# Altium project NXP_FRDM_IMX93.PrjPcb (part 12 of 13)

## Sheet E-21 DEBUG_RTC_USB A_CAN.SchDoc: FRDM-IMX93
size 513 x 386 mm; DrawnBy: FORLINX; Organization: ORGANIZATION; Address1: ADDRESS 1; Address2: ADDRESS 2; Address3: ADDRESS 3; Address4: ADDRESS 4; Revision: -; ENG_APP_DATE: --/--/--; DSN_APP_DATE: --/--/--; CHK_APP_DATE: --/--/--; Classification: Public, Company Internal/Proprietary, Company Confidential,  Company Secret; Page Create Date: March  8, 1995; OrgName: NXP Semiconductor; FIUO: A; OrgAddr1: NO. 192 Liangjing Rd. Pudong New Area, ShangHai; Page Number: 21; PageTitle: DEBUG/RTC/USB A/CAN; Page Size: C; Page Count: 23; Designer: FORLINX; RevCode: B1; Approver: NXP SE; Doc: SCH-94611 PDF: SPF-94611; DsnPath: T:\FILES\Designs\Single Board Computers\i.MX93-FRDM\Design Files\SCH-94611_B1.DSN; SchematicName: FRDM-i.MX 93 Development Board; PageName: E-21 DEBUG/RTC/USB A/CAN; PageSize: C; TopSchematic: True
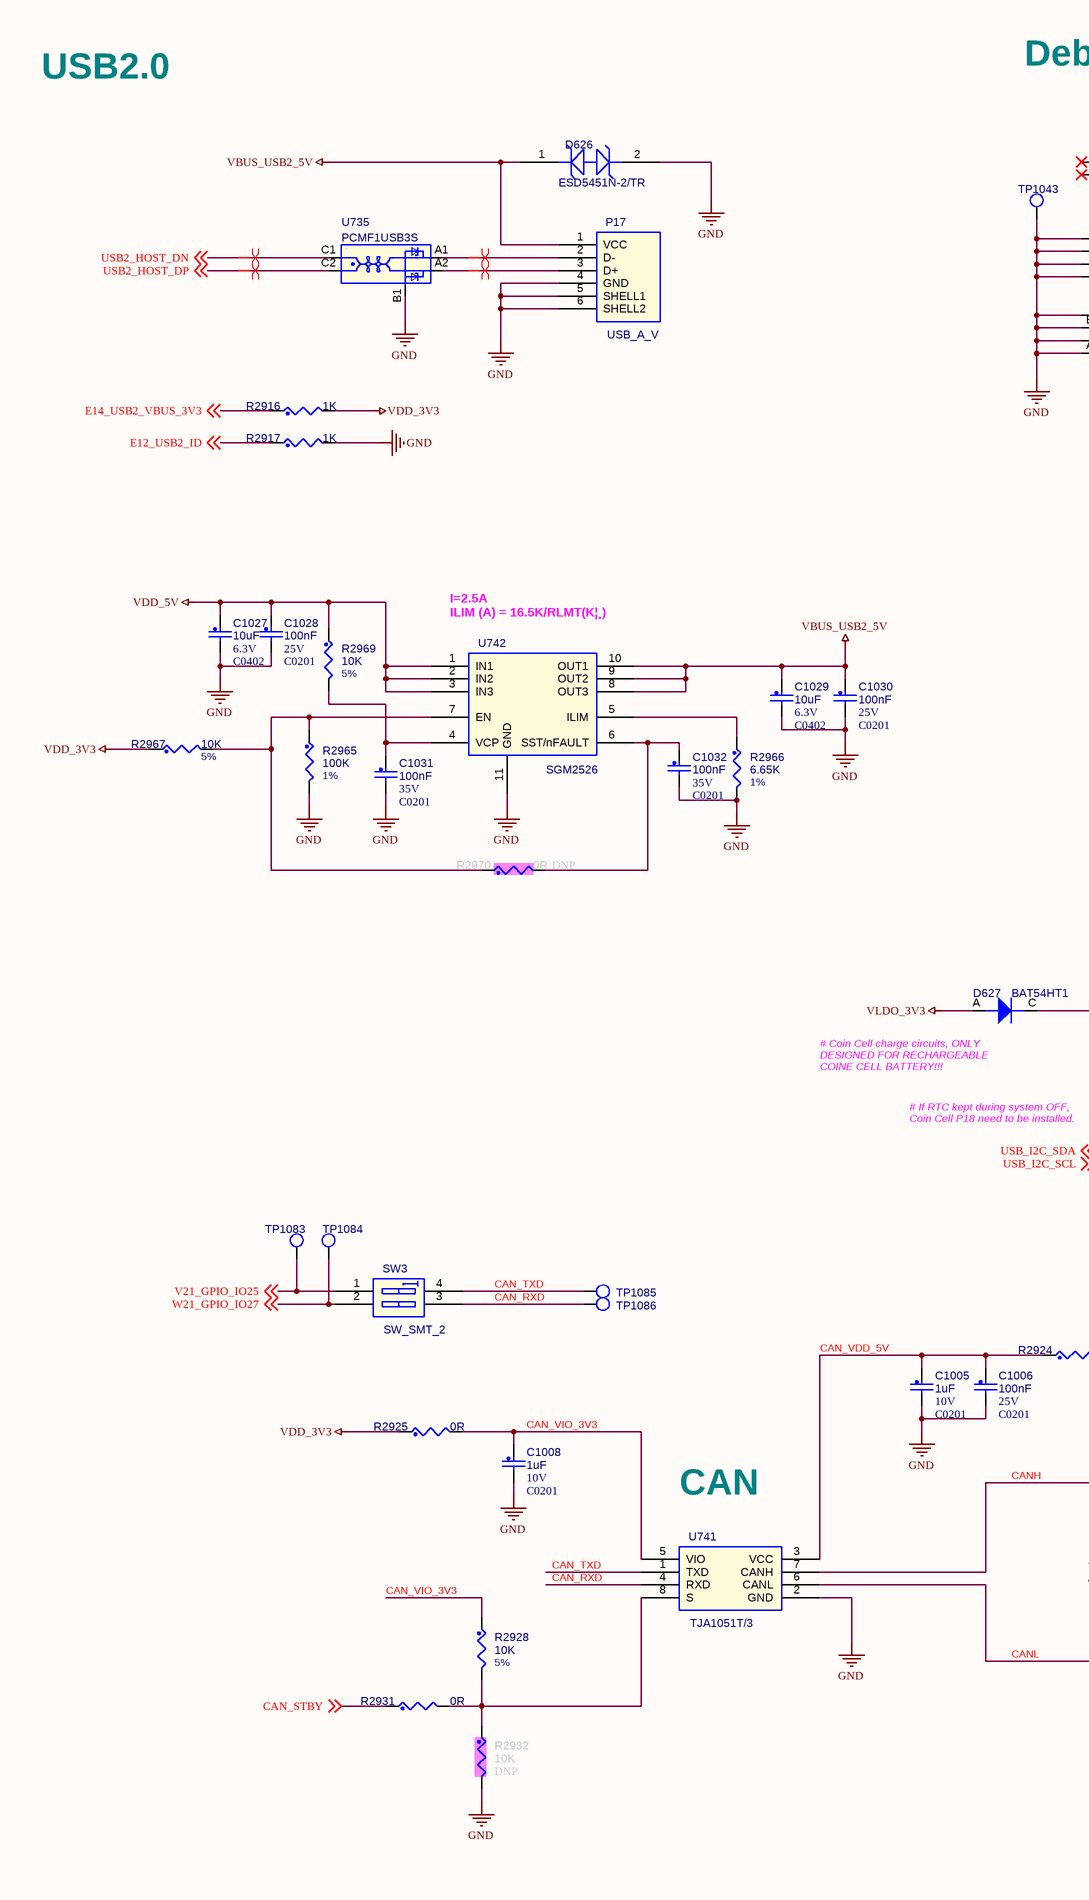
[diagram p37: E-21 DEBUG_RTC_USB A_CAN.SchDoc, left]
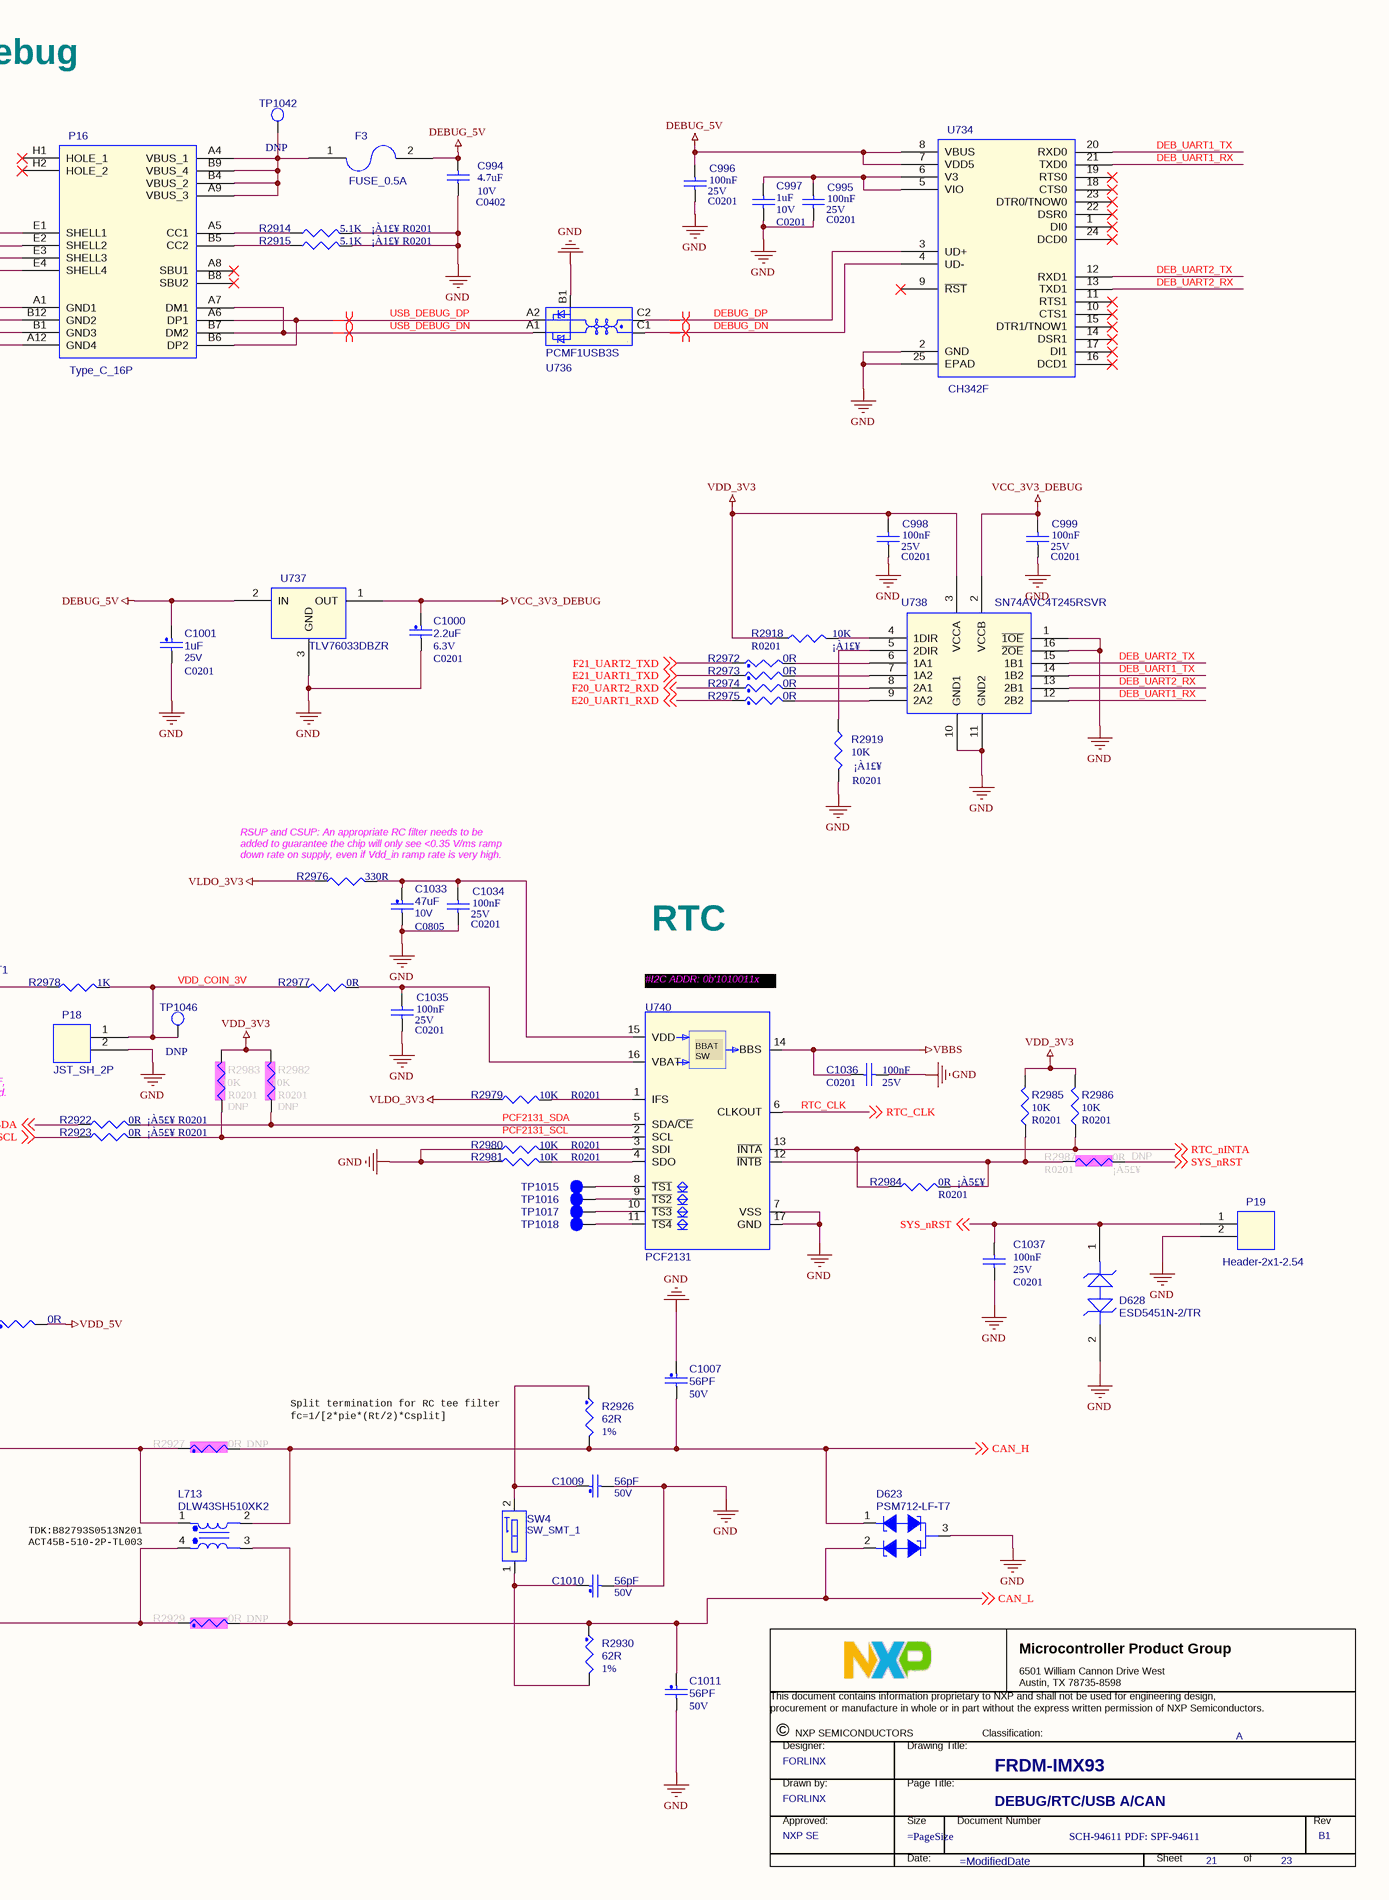
[diagram p38: E-21 DEBUG_RTC_USB A_CAN.SchDoc, right]

### Parts
(Parts that share a designator on the sheet are numbered #1, #2 ... from top to bottom, then left to right.)
*#21  Title: FRDM-IMX93  RevCode: B1  PageTitle: DEBUG/RTC/USB A/CAN  Page Number: 21  Page Count: 23  DrawnBy: FORLINX  Doc: SCH-94611 PDF: SPF-94611  Approver: NXP SE  FIUO: A  (graphical)
C994  4.7uF  Voltage: 10V  [C0402]
C995  100nF  Voltage: 25V  [C0201]
C996  100nF  Voltage: 25V  [C0201]
C997  1uF  Voltage: 10V  [C0201]
C998  100nF  Voltage: 25V  [C0201]
C999  100nF  Voltage: 25V  [C0201]
C1000  2.2uF  VOLTAGE: 6.3V  [C0201]
C1001  1uF  Rated Voltage: 25V  [C0201]
C1005  1uF  VOLTAGE: 10V  [C0201]
C1006  100nF  VOLTAGE: 25V  [C0201]
C1007  56PF  VOLTAGE: 50V  [C0402]
C1008  1uF  VOLTAGE: 10V  [C0201]
C1009  56pF  VOLTAGE: 50V  [C0402]
C1010  56pF  VOLTAGE: 50V  [C0402]
C1011  56PF  VOLTAGE: 50V  [C0402]
C1027  10uF  VOLTAGE: 6.3V  [C0402]
C1028  100nF  VOLTAGE: 25V  [C0201]
C1029  10uF  VOLTAGE: 6.3V  [C0402]
C1030  100nF  VOLTAGE: 25V  [C0201]
C1031  100nF  VOLTAGE: 35V  [C0201]
C1032  100nF  VOLTAGE: 35V  [C0201]
C1033  47uF  Rated Voltage: 10V  [C0805]
C1034  100nF  Voltage: 25V  [C0201]
C1035  100nF  Voltage: 25V  [C0201]
C1036  100nF  Voltage: 25V  [C0201]
C1037  100nF  Voltage: 25V  [C0201]
D623  PSM712-LF-T7  [sot23_a]
D626  ESD5451N-2/TR  [0402TVS]
D627  BAT54HT1  [SOD323]
D628  ESD5451N-2/TR  [0402TVS]
F3  FUSE_0.5A  [F1206]
L713  DLW43SH510XK2  [IND_DLW43]
P16  Type_C_16P  [TypeC_16P_S]
P17  USB_A_V  [USB_A_V]
P18  JST_SH_2P  [sh_2p]
P19  Header-2x1-2.54  [Header_2x1_254]
R2914  5.1K  precision: ¡À1£¥  [R0201]
R2915  5.1K  precision: ¡À1£¥  [R0201]
R2916  1K  [R0201]
R2917  1K  [R0201]
R2918  10K  precision: ¡À1£¥  [R0201]
R2919  10K  precision: ¡À1£¥  [R0201]
R2922  0R  precision: ¡À5£¥  [R0201]
R2923  0R  precision: ¡À5£¥  [R0201]
R2924  0R  [R0402]
R2925  0R  [R0402]
R2926  62R  Tolerance: 1%  [R0603]
R2927  0R  ASSY_OPT: DNP  [R0402]
R2928  10K  Tolerance: 5%  [R0201]
R2929  0R  ASSY_OPT: DNP  [R0402]
R2930  62R  Tolerance: 1%  [R0603]
R2931  0R  [R0201]
R2932  10K  ASSY_OPT: DNP  [R0201]
R2965  100K  Tolerance: 1%  [R0201]
R2966  6.65K  Tolerance: 1%  [R0402]
R2967  10K  Tolerance: 5%  [R0201]
R2969  10K  Tolerance: 5%  [R0201]
R2970  0R  ASSY_OPT: DNP  [R0201]
R2972  0R  [R0201]
R2973  0R  [R0201]
R2974  0R  [R0201]
R2975  0R  [R0201]
R2976  330R  [R0402]
R2977  0R  [R0402]
R2978  1K  [R0402]
R2979  10K  [R0201]
R2980  10K  [R0201]
R2981  10K  [R0201]
R2982  10K  ASSY_OPT: DNP  [R0201]
R2983  10K  ASSY_OPT: DNP  [R0201]
R2984  0R  precision: ¡À5£¥  [R0201]
R2985  10K  [R0201]
R2986  10K  [R0201]
R2987  0R  precision: ¡À5£¥  ASSY_OPT: DNP  [R0201]
SW3  SW_SMT_2  [SW_SMT_4]
SW4  SW_SMT_1  [sw_2p8x5p4_sm]
TP1015  TPAD_015  [tpad_015]  (value not drawn)
TP1016  TPAD_015  [tpad_015]  (value not drawn)
TP1017  TPAD_015  [tpad_015]  (value not drawn)
TP1018  TPAD_015  [tpad_015]  (value not drawn)
TP1042  ASSY_OPT: DNP  [tpad_020]  (hidden comment: TPAD_020)
TP1043  TPAD_020  [tpad_020]  (value not drawn)
TP1046  ASSY_OPT: DNP  [tpad_020]  (hidden comment: TPAD_020)
TP1083  TPAD_020  [tpad_020]  (value not drawn)
TP1084  TPAD_020  [tpad_020]  (value not drawn)
TP1085  TPAD_020  [tpad_020]  (value not drawn)
TP1086  TPAD_020  [tpad_020]  (value not drawn)
U734  CH342F  [QFN24P_0_5]
U735  PCMF1USB3S  [wlcsp5_0p4_0p82x1p22]
U736  PCMF1USB3S  [wlcsp5_0p4_0p82x1p22]
U737  TLV76033DBZR  [sot23_a]
U738  SN74AVC4T245RSVR  [UQFN16_26x18]
U740  PCF2131  [so16_0p5_3p5x4p5_mm]
U741  TJA1051T/3  [SOP8_1_27]
U742  SGM2526  [tdfn_3x3_10l]

### Nets
DEBUG_5V: C994.1 C996.1 C1001.1 F3.2 U734.7(VDD5) U734.8(VBUS) U737.2(IN)
GND: C994.2 C995.2 C996.2 C997.2 C998.2 C999.2 C1000.2 C1001.2 C1005.2 C1006.2 C1007.1 C1008.2 C1009.2 C1010.2 C1011.2 C1027.2 C1028.2 C1029.2 C1030.2 C1031.2 C1032.2 C1033.2 C1034.2 C1035.2 C1036.2 C1037.1 D623.3(COM_CATHODE) D626.2 D628.2 P16.A1(GND1) P16.A12(GND4) P16.B1(GND3) P16.B12(GND2) P16.E1(SHELL1) P16.E2(SHELL2) P16.E3(SHELL3) P16.E4(SHELL4) P17.4(GND) P17.5(SHELL1) P17.6(SHELL2) P18.2 P19.2 R2914.2 R2915.2 R2917.2 R2919.2 R2932.2 R2965.2 R2966.2 R2980.1 R2981.1 TP1043.1(TP) U734.2(GND) U734.25(EPAD) U735.B1(GND) U736.B1(GND) U737.3(GND) U738.1(~{1OE}) U738.10(GND1) U738.11(GND2) U738.16(~{2OE}) U740.7(VSS) U740.17(GND) U741.2(GND) U742.11(GND)
VBBS: C1036.1 U740.14(BBS)
VBUS_USB2_5V: C1029.1 C1030.1 D626.1 P17.1(VCC) U742.8(OUT3) U742.9(OUT2) U742.10(OUT1)
VCC_3V3_DEBUG: C999.1 C1000.1 U737.1(OUT) U738.2(VCCB)
VDD_3V3: C998.1 R2916.2 R2918.1 R2925.1 R2967.1 R2982.2 R2983.2 R2985.2 R2986.2 U738.3(VCCA)
VDD_5V: C1027.1 C1028.1 R2924.2 R2969.1 U742.1(IN1) U742.2(IN2) U742.3(IN3)
VLDO_3V3: D627.A(ANODE) R2976.1 R2979.1
CAN_H: C1007.2 D623.1(CATHODE1) L713.2 R2926.2 R2927.2 ; off-sheet CAN_H
CAN_L: C1011.1 D623.2(CATHODE2) L713.3 R2929.2 R2930.1 ; off-sheet CAN_L
CAN_RXD: SW3.3 TP1086.1(TP) U741.4(RXD)
CAN_STBY: R2931.1 ; off-sheet CAN_STBY
CAN_TXD: SW3.4 TP1085.1(TP) U741.1(TXD)
CAN_VDD_5V: C1005.1 C1006.1 R2924.1 U741.3(VCC)
CAN_VIO_3V3: C1008.1 R2925.2 R2928.1 U741.5(VIO)
CANH: L713.1 R2927.1 U741.7(CANH)
CANL: L713.4 R2929.1 U741.6(CANL)
DEB_UART1_RX: U734.21(TXD0) U738.12(2B2)
DEB_UART1_TX: U734.20(RXD0) U738.14(1B2)
DEB_UART2_RX: U734.13(TXD1) U738.13(2B1)
DEB_UART2_TX: U734.12(RXD1) U738.15(1B1)
DEBUG_DN: U734.4(UD-) U736.C1(CH1_OUT+)
DEBUG_DP: U734.3(UD+) U736.C2(CH1_OUT-)
E12_USB2_ID: R2917.1 ; off-sheet E12_USB2_ID  [project net USB2_ID]
E14_USB2_VBUS_3V3: R2916.1 ; off-sheet E14_USB2_VBUS_3V3
E20_UART1_RXD: R2975.1 ; off-sheet E20_UART1_RXD  [project net UART1_RXD]
E21_UART1_TXD: R2973.1 ; off-sheet E21_UART1_TXD  [project net #BOOT_MODE0]
F20_UART2_RXD: R2974.1 ; off-sheet F20_UART2_RXD  [project net UART2_RXD]
F21_UART2_TXD: R2972.1 ; off-sheet F21_UART2_TXD  [project net #BOOT_MODE1]
PCF2131_SCL: R2923.2 R2983.1 U740.2(SCL)
PCF2131_SDA: R2922.2 R2982.1 U740.5(SDA/~{CE})
RTC_CLK: U740.6(CLKOUT) ; off-sheet RTC_CLK
RTC_nINTA: R2984.1 R2986.1 U740.13(~{INTA}) ; off-sheet RTC_nINTA
SYS_nRST: C1037.2 D628.1 P19.1 R2987.2 ; off-sheet SYS_nRST
USB2_HOST_DN: U735.C1(CH1_OUT+) ; off-sheet USB2_HOST_DN
USB2_HOST_DP: U735.C2(CH1_OUT-) ; off-sheet USB2_HOST_DP
USB_DEBUG_DN: P16.A7(DM1) P16.B7(DM2) U736.A1(CH1_IN+)
USB_DEBUG_DP: P16.A6(DP1) P16.B6(DP2) U736.A2(CH1_IN-)
USB_I2C_SCL: R2923.1 ; off-sheet USB_I2C_SCL
USB_I2C_SDA: R2922.1 ; off-sheet USB_I2C_SDA
V21_GPIO_IO25: SW3.1 TP1083.1(TP) ; off-sheet V21_GPIO_IO25  [project net EXP_GPIO_IO25]
VDD_COIN_3V: P18.1 R2977.1 R2978.2 TP1046.1(TP)
W21_GPIO_IO27: SW3.2 TP1084.1(TP) ; off-sheet W21_GPIO_IO27  [project net EXP_GPIO_IO27]
NetC995_1: C995.1 C997.1 U734.5(VIO) U734.6(V3)
NetC1009_1: C1009.1 R2926.1 SW4.2(COMMON)
NetC1010_1: C1010.1 R2930.2 SW4.1(NC)
NetC1031_1: C1031.1 R2969.2 U742.4(VCP)
NetC1032_1: C1032.1 R2970.2 U742.6(SST/nFAULT)
NetC1033_1: C1033.1 C1034.1 R2976.2 U740.15(VDD)
NetC1035_1: C1035.1 R2977.2 U740.16(VBAT)
NetD627_C: D627.C(CATHODE) R2978.1
NetF3_1: F3.1 P16.A4(VBUS_1) P16.A9(VBUS_3) P16.B4(VBUS_2) P16.B9(VBUS_4) TP1042.1(TP)
NetP16_A5: P16.A5(CC1) R2914.1
NetP16_B5: P16.B5(CC2) R2915.1
NetP17_2: P17.2(D-) U735.A1(CH1_IN+)
NetP17_3: P17.3(D+) U735.A2(CH1_IN-)
NetR2918_2: R2918.2 U738.4(1DIR)
NetR2919_1: R2919.1 U738.5(2DIR)
NetR2928_2: R2928.2 R2931.2 R2932.1 U741.8(S)
NetR2965_1: R2965.1 R2967.2 R2970.1 U742.7(EN)
NetR2966_1: R2966.1 U742.5(ILIM)
NetR2972_2: R2972.2 U738.6(1A1)
NetR2973_2: R2973.2 U738.7(1A2)
NetR2974_2: R2974.2 U738.8(2A1)
NetR2975_2: R2975.2 U738.9(2A2)
NetR2979_2: R2979.2 U740.1(IFS)
NetR2980_2: R2980.2 U740.3(SDI)
NetR2981_2: R2981.2 U740.4(SDO)
NetR2984_2: R2984.2 R2985.1 R2987.1 U740.12(~{INTB})
NetTP1015_1: TP1015.1(Pin1) U740.8(~{TS1})
NetTP1016_1: TP1016.1(Pin1) U740.9(~{TS2})
NetTP1017_1: TP1017.1(Pin1) U740.10(~{TS3})
NetTP1018_1: TP1018.1(Pin1) U740.11(~{TS4})

Not connected (* = marked no-connect by the designer): P16 A8(SBU1)* B8(SBU2)* H1(HOLE_1)* H2(HOLE_2)*; U734 1(DI0)* 9(~{RST})* 10(CTS1)* 11(RTS1)* 14(DSR1)* 15(DTR1/TNOW1)* 16(DCD1)* 17(DI1)* 18(CTS0)* 19(RTS0)* 22(DSR0)* 23(DTR0/TNOW0)* 24(DCD0)*

### Layout directives
differential pair: DEBUG_DN, DEBUG_DP, NetP17_2, NetP17_3, USB2_HOST_DN, USB2_HOST_DP, USB_DEBUG_DN, USB_DEBUG_DP

### Notes on the sheet
- USB2.0
- Debug
- (near U742) I=2.5A
  ILIM (A) = 16.5K/RLMT(K¦¸)
- (near R2976) RSUP and CSUP: An appropriate RC filter needs to be
  added to guarantee the chip will only see <0.35 V/ms ramp
  down rate on supply, even if Vdd_in ramp rate is very high.
- RTC
- #I2C ADDR: 0b'1010011x
- (near D627) # Coin Cell charge circuits, ONLY
  DESIGNED FOR RECHARGEABLE
  COINE CELL BATTERY!!!
- # If RTC kept during system OFF,
  Coin Cell P18 need to be installed.
- Split termination for RC tee filter
- CAN
- fc=1/[2*pie*(Rt/2)*Csplit]
- (near L713) TDK:B82793S0513N201
  ACT45B-510-2P-TL003
- DWG. NO.
- REV.
- SHT.
- REVISION
- DESCRIPTION
- DATE
- APPROVED
- ENG:
- APPROVALS
- quilter.ai <http://quilter.ai>
- DSN:
- CHK:
- REFERENCE DOCUMENTS
- TITLE
- PROJECT
- BOM:
- FAB DWG:
- PCB DWG:
- ASSY DWG:
- SIZE
- FILE NAME
- C
- DWG NO.
- SHEET
- OF
- REV
- (in symbol PCF2131_4) BBAT / SW
- (in symbol TitleBlock_MCPG) Microcontroller Product Group; 6501 William Cannon Drive West / Austin, TX 78735-8598; This document contains information proprietary to NXP and shall not be used for engineering design,; procurement or manufacture in whole or in part without the express written permission of NXP Semiconductors.; ©; NXP SEMICONDUCTORS; Classification:; Designer:; Drawing Title:; Drawn by:; Page Title:; Approved:; Size; Document Number; Rev; Date:; Sheet; of

### Library data of the parts
*#21 = TitleBlock_MCPG: Classification: Public, Company Internal/Proprietary, Company Confidential,  Company Secret; OrgAddr1: NO. 192 Liangjing Rd. Pudong New Area, ShangHai; OrgName: NXP Semiconductor; Page Size: =PageSize; Page Create Date: March  8, 1995; Designer: FORLINX; Page Modify Date: =ModifiedDate
C994 = C0603,4.7uF: 0402,4.7uF,10V,+/-10%,X5R; Part Reference: C994; serial number: 1110203056; MFG_NAME01: SAMSUNG; MFG_PN01: CL05A475KP5NRNC; PCB Footprint: C0402; Value: 4.7uF
C995 = C0402,100nF,16V: 0201,100nF,25V,+/-10%,X5R; Part Reference: C995; serial number: 1110202001; MFG_NAME01: FENGHUA; MFG_PN01: 0201X104K250NT; PCB Footprint: C0201; Value: 100nF
C996 = C0402,100nF,16V: 0201,100nF,25V,+/-10%,X5R; Part Reference: C996; serial number: 1110202001; MFG_NAME01: FENGHUA; MFG_PN01: 0201X104K250NT; PCB Footprint: C0201; Value: 100nF
C997 = C0402,1uF,16V: 0201,1uF,10V,+/-20%,X5R; Part Reference: C997; serial number: 1110202021; MFG_NAME01: SAMSUNG; MFG_PN01: CL03A105MP3NSNC; PCB Footprint: C0201; Value: 1uF
C998 = C0402,100nF,16V: 0201,100nF,25V,+/-10%,X5R; Part Reference: C998; serial number: 1110202001; MFG_NAME01: FENGHUA; MFG_PN01: 0201X104K250NT; PCB Footprint: C0201; Value: 100nF
C999 = C0402,100nF,16V: 0201,100nF,25V,+/-10%,X5R; Part Reference: C999; serial number: 1110202001; MFG_NAME01: FENGHUA; MFG_PN01: 0201X104K250NT; PCB Footprint: C0201; Value: 100nF
C1000 = CAP_NP: 0201,2.2uf,6.3V,+/-20%,X5R; Part Reference: C1000; CLASS: DISCRETE; Tolerance: 10%; MFG_NAME01: SAMSUNG; MFG_PN01: CL03A225MQ3CRNC; CAD_APPROVED: Yes; FPLIST: CC0402_25,CC0402_HD,0402_CC,capc0402_l; Value: 2.2uF; Package Size: 0402; ROHS: Yes; HEIGHT: 0.55 MM; PCB Footprint: C0201
C1001 = CAP_NP: 0201,1uF,10V,+/-20%,X5R; Part Reference: C1001; CLASS: DISCRETE; MFG_PN01: CL03A105MP3NSNC; MFG_NAME01: SAMSUNG; Temp Range: -55C to +125C; CAD_APPROVED: Yes; Tolerance: 10%; FPLIST: CC0603_OV,CC0603,0603_CC; Value: 1uF; ROHS: Yes; Package Type: Surface Mount, MLCC; HEIGHT: 0.9MM; Package Size: 0603 (1608 Metric); PCB Footprint: C0201
C1005 = CAP_NP: 0201,1uF,10V,+/-20%,X5R; Part Reference: C1005; CLASS: DISCRETE; FPLIST: CC0402_25,CC0402_HD,0402_CC,capc0402_l; CAD_APPROVED: Yes; MFG_PN01: CL03A105MP3NSNC; MFG_NAME01: SAMSUNG; Tolerance: 10%; Value: 1uF; HEIGHT: 0.55 MM; ROHS: Yes; PCB Footprint: C0201
C1006 = CAP_NP: 0201,100nF,25V,+/-10%,X5R; Part Reference: C1006; CLASS: DISCRETE; Tolerance: 10%; MFG_NAME01: FENGHUA; MFG_PN01: 0201X104K250NT; CAD_APPROVED: Yes; FPLIST: CC0402_25,CC0402_HD,0402_CC,capc0402_l; Value: 100nF; ROHS: Yes; HEIGHT: 0.55MM; PCB Footprint: C0201
C1007 = CAP_NP: 0402,56pF,50V,+/-5%,COG; Part Reference: C1007; CLASS: DISCRETE; Tolerance: 5%; MFG_NAME01: FENGHUA; MFG_PN01: 0402CG560J500NT; CAD_APPROVED: Yes; FPLIST: CC0402_25,CC0402_HD,0402_CC; Value: 56PF; ROHS: Yes; HEIGHT: 0.55 MM; PCB Footprint: C0402
C1008 = CAP_NP: 0201,1uF,10V,+/-20%,X5R; Part Reference: C1008; CLASS: DISCRETE; FPLIST: CC0402_25,CC0402_HD,0402_CC,capc0402_l; CAD_APPROVED: Yes; MFG_PN01: CL03A105MP3NSNC; MFG_NAME01: SAMSUNG; Tolerance: 10%; Value: 1uF; HEIGHT: 0.55 MM; ROHS: Yes; PCB Footprint: C0201
C1009 = CAP_NP: 0402,56pF,50V,+/-5%,COG; Part Reference: C1009; CLASS: DISCRETE; FPLIST: CC0402_25,CC0402_HD,0402_CC,capc0402_l; Tolerance: 5%; CAD_APPROVED: Yes; Temp Range: -55C to +125C; MFG_NAME01: FENGHUA; MFG_PN01: 0402CG560J500NT; Value: 56pF; Package Size: 0402; HEIGHT: 0.55 MM; ROHS: Yes; PCB Footprint: C0402
C1010 = CAP_NP: 0402,56pF,50V,+/-5%,COG; Part Reference: C1010; CLASS: DISCRETE; MFG_PN01: 0402CG560J500NT; MFG_NAME01: FENGHUA; Temp Range: -55C to +125C; CAD_APPROVED: Yes; Tolerance: 5%; FPLIST: CC0402_25,CC0402_HD,0402_CC,capc0402_l; Value: 56pF; ROHS: Yes; HEIGHT: 0.55 MM; Package Size: 0402; PCB Footprint: C0402
C1011 = CAP_NP: 0402,56pF,50V,+/-5%,COG; Part Reference: C1011; CLASS: DISCRETE; FPLIST: CC0402_25,CC0402_HD,0402_CC; CAD_APPROVED: Yes; MFG_PN01: 0402CG560J500NT; MFG_NAME01: FENGHUA; Tolerance: 5%; Value: 56PF; HEIGHT: 0.55 MM; ROHS: Yes; PCB Footprint: C0402
C1027 = CAP_NP: 0402,10uF,6.3V,+/-20%,X5R; Part Reference: C1027; CLASS: DISCRETE; FPLIST: CC0603_OV,CC0603,0603_CC_NSP; CAD_APPROVED: Yes; MFG_PN01: 0402X106M6R3NT; MFG_NAME01: FENGHUA; Tolerance: 20%; Temp_Range: -55¡ãC ~ 85¡ãC; Value: 10uF; Package Type: SMD; Package Size: 0603; HEIGHT: 1MM; ROHS: Yes; LEAD_FREE: YES; PCB Footprint: C0402
C1028 = CAP_NP: 0201,100nF,25V,+/-10%,X5R; Part Reference: C1028; CLASS: DISCRETE; FPLIST: CC0402_25,CC0402_HD,0402_CC,capc0402_l; Tolerance: 10%; CAD_APPROVED: Yes; MFG_NAME01: FENGHUA; MFG_PN01: 0201X104K250NT; Value: 100nF; HEIGHT: 0.55MM; ROHS: Yes; PCB Footprint: C0201
C1029 = CAP_NP: 0402,10uF,6.3V,+/-20%,X5R; Part Reference: C1029; CLASS: DISCRETE; LEAD_FREE: YES; Temp_Range: -55¡ãC ~ 85¡ãC; Tolerance: 20%; MFG_NAME01: FENGHUA; MFG_PN01: 0402X106M6R3NT; FPLIST: CC0603_OV,CC0603,0603_CC_NSP; Value: 10uF; Package Type: SMD; Package Size: 0603; ROHS: Yes; CAD_APPROVED: Yes; HEIGHT: 1MM; PCB Footprint: C0402
C1030 = CAP_NP: 0201,100nF,25V,+/-10%,X5R; Part Reference: C1030; CLASS: DISCRETE; Temp Range: -55C to +125C; Rated Voltage: 50V; TOL: 10%; FPLIST: CC0402_25,CC0402_HD,0402_CC,capc0402_l; CAD_APPROVED: Yes; MFG_PN01: 0201X104K250NT; MFG_NAME01: FENGHUA; EN: 102-1-02300; Value: 100nF; HEIGHT: 0.6 MM; ROHS: Yes; Tolerance: 10%; PCB Footprint: C0201
C1031 = CAP_NP: 0201,100nF,25V,+/-10%,X5R; Part Reference: C1031; CLASS: DISCRETE; EN: 102-1-02300; Tolerance: 10%; MFG_NAME01: FENGHUA; MFG_PN01: 0201X104K250NT; CAD_APPROVED: Yes; FPLIST: CC0402_25,CC0402_HD,0402_CC,capc0402_l; Rated Voltage: 50V; Temp Range: -55C to +125C; Value: 100nF; ROHS: Yes; HEIGHT: 0.6 MM; TOL: 10%; PCB Footprint: C0201
C1032 = CAP_NP: 0201,100nF,25V,+/-10%,X5R; Part Reference: C1032; CLASS: DISCRETE; EN: 102-1-02300; Tolerance: 10%; MFG_NAME01: FENGHUA; MFG_PN01: 0201X104K250NT; CAD_APPROVED: Yes; FPLIST: CC0402_25,CC0402_HD,0402_CC,capc0402_l; Rated Voltage: 50V; Temp Range: -55C to +125C; Value: 100nF; ROHS: Yes; HEIGHT: 0.6 MM; TOL: 10%; PCB Footprint: C0201
C1033 = CAP_NP: 0805,47uF,10V,+/-20%,X5R; Part Reference: C1033; CLASS: DISCRETE; FPLIST: CC0603_OV,CC0603,0603_CC; Tolerance: 10%; CAD_APPROVED: Yes; Temp Range: -55C to +125C; MFG_NAME01: MURATA; MFG_PN01: GRM21BR61A476ME15L; Value: 47uF; Package Size: 0603 (1608 Metric); HEIGHT: 0.9MM; Package Type: Surface Mount, MLCC; ROHS: Yes; PCB Footprint: C0805
C1034 = C0402,100nF,16V: 0201,100nF,25V,+/-10%,X5R; Part Reference: C1034; serial number: 1110202001; MFG_NAME01: FENGHUA; MFG_PN01: 0201X104K250NT; PCB Footprint: C0201; Value: 100nF
C1035 = C0402,100nF,16V: 0201,100nF,25V,+/-10%,X5R; Part Reference: C1035; serial number: 1110202001; MFG_NAME01: FENGHUA; MFG_PN01: 0201X104K250NT; PCB Footprint: C0201; Value: 100nF
C1036 = C0402,100nF,16V: 0201,100nF,25V,+/-10%,X5R; Part Reference: C1036; serial number: 1110202001; MFG_NAME01: FENGHUA; MFG_PN01: 0201X104K250NT; PCB Footprint: C0201; Value: 100nF
C1037 = C0402,100nF,16V: 0201,100nF,25V,+/-10%,X5R; Part Reference: C1037; serial number: 1110202001; MFG_NAME01: FENGHUA; MFG_PN01: 0201X104K250NT; PCB Footprint: C0201; Value: 100nF
D623 = ESD_DIODE_2LINE: PSM712-LF-T7,SOT-23-3; Part Reference: D623; CLASS: IC; Rated Voltage: 24V; MFG_NAME01: UMW; Value: PSM712-LF-T7; MFG_PN01: PSM712-LF-T7; Rated Power: -; HEIGHT: 1.1MM; Package Size: TO-236-3, SC-59, SOT-23-3; PCB Footprint: sot23_a
D626 = ESD5451N-2/TR: Part Reference: D626; MFG_NAME01: WILLSEMI; Value: ESD5451N-2/TR; MFG_PN01: ESD5451N-2/TR; PCB Footprint: 0402TVS
D627 = DIODE: BAT54HT1G,SOD323; Part Reference: D627; CLASS: IC; MFG_NAME01: JSCJ; CAD_APPROVED: Yes; Value: BAT54HT1; MFG_PN01: BAT54HT1G; HEIGHT: 1.15MM; PCB Footprint: SOD323
D628 = ESD5451N-2/TR: Part Reference: D628; MFG_NAME01: WILLSEMI; Value: ESD5451N-2/TR; MFG_PN01: ESD5451N-2/TR; PCB Footprint: 0402TVS
F3 = FUSE_0.5A: 1206,0.5A/1A,13.2V; Part Reference: F3; MFG_NAME01: BOURNS; MFG_PN01: MF-NSMF050; Value: FUSE_0.5A; PCB Footprint: F1206
L713 = DLW43: IND CHK 51uH@1MHZ 230mA -30%/+50% 1812; Part Reference: L713; CLASS: DISCRETE; MFG_NAME01: MURATA; Value: DLW43SH510XK2; MFG_PN01: DLW43SH510XK2; PCB Footprint: IND_DLW43
P16 = Type_C_16P: USB616FC-C2014216,USB2.0,type-c; Part Reference: P16; MFG_NAME01: ATOM; Value: Type_C_16P; MFG_PN01: USB616FC-C2014216; PCB Footprint: TypeC_16P_S
P17 = USB_A_V: USB2.0,Type A, female seat, single-layer, vertical lying, short body, length 14mm; Part Reference: P17; MFG_NAME01: anuoconn; MFG_PN01: USB2-A-14mm; Value: USB_A_V; PCB Footprint: USB_A_V
P18 = JST_SH_2P: A1001-02AB,Tin plating, busbar, 2P, 1mm spacing, vertical mounting; Part Reference: P18; MFG_NAME01: HONGYI; Value: JST_SH_2P; MFG_PN01: A1001-02AB; PCB Footprint: sh_2p
P19 = Header-2x1-2.54: XH,2P,2.54mm,S; Part Reference: P19; MFG_NAME01: LHE; MFG_PN01: XH-2P-2.54mm-S; Value: Header-2x1-2.54; PCB Footprint: Header_2x1_254
R2914 = R0402,4.7K: 0201,5.1K,+/-1%; Part Reference: R2914; serial number: 1110102015; MFG_NAME01: FENGHUA; MFG_PN01: RC-01W5101FT; PCB Footprint: R0201; Value: 5.1K
R2915 = R0402,4.7K: 0201,5.1K,+/-1%; Part Reference: R2915; serial number: 1110102015; MFG_NAME01: FENGHUA; MFG_PN01: RC-01W5101FT; PCB Footprint: R0201; Value: 5.1K
R2916 = RES: 0201,1K,+/-1%; Part Reference: R2916; CLASS: DISCRETE; VOLTAGE: 1/16W; Tolerance: 5%; MFG_NAME01: FENGHUA; MFG_PN01: RC-01W1001FT; CAD_APPROVED: Yes; FPLIST: RC0402_25,RC0402_HD,RC0402_X2,0402_CC; Value: 1K; HEIGHT: 0.45 MM; ROHS: Yes; PCB Footprint: R0201
R2917 = RES: 0201,1K,+/-1%; Part Reference: R2917; CLASS: DISCRETE; VOLTAGE: 1/16W; Tolerance: 5%; MFG_NAME01: FENGHUA; MFG_PN01: RC-01W1001FT; CAD_APPROVED: Yes; FPLIST: RC0402_25,RC0402_HD,RC0402_X2,0402_CC; Value: 1K; HEIGHT: 0.45 MM; ROHS: Yes; PCB Footprint: R0201
R2918 = R0402,10K: 0201,10K,+/-5%; Part Reference: R2918; serial number: 1110102037; MFG_NAME01: FENGHUA; MFG_PN01: RC-01W103JT; PCB Footprint: R0201; Value: 10K
R2919 = R0402,10K: 0201,10K,+/-5%; Part Reference: R2919; serial number: 1110102037; MFG_NAME01: FENGHUA; MFG_PN01: RC-01W103JT; PCB Footprint: R0201; Value: 10K
R2922 = R0402,0R: 0201,0Ohm,+/-5%; Part Reference: R2922; serial number: 1110102001; MFG_NAME01: FENGHUA; MFG_PN01: RC-01000JT; PCB Footprint: R0201; Value: 0R
R2923 = R0402,0R: 0201,0Ohm,+/-5%; Part Reference: R2923; serial number: 1110102001; MFG_NAME01: FENGHUA; MFG_PN01: RC-01000JT; PCB Footprint: R0201; Value: 0R
R2924 = RES: 0402,0Ohm,+/-1%; Part Reference: R2924; CLASS: DISCRETE; Tolerance: 5%; MFG_NAME01: FENGHUA; MFG_PN01: RC-02000FT; CAD_APPROVED: Yes; FPLIST: RC0402_25,RC0402_HD,RC0402_X2,0402_CC; VOLTAGE: 1/16W; Value: 0R; HEIGHT: 0.45 MM; ROHS: Yes; PCB Footprint: R0402
R2925 = RES: 0402,0Ohm,+/-1%; Part Reference: R2925; CLASS: DISCRETE; VOLTAGE: 1/16W; FPLIST: RC0402_25,RC0402_HD,RC0402_X2,0402_CC; CAD_APPROVED: Yes; MFG_PN01: RC-02000FT; MFG_NAME01: FENGHUA; Tolerance: 5%; Value: 0R; ROHS: Yes; HEIGHT: 0.45 MM; PCB Footprint: R0402
R2926 = RES: 0603,62Ohm,+/-5%; Part Reference: R2926; CLASS: DISCRETE; MFG_PN01: RS-03K620JT; MFG_NAME01: FENGHUA; Temp Range: -55C to +155C; CAD_APPROVED: Yes; FPLIST: RC0603_OV,RC0603,0603_CC; Value: 62R; ROHS: Yes; HEIGHT: 0.55MM; PCB Footprint: R0603
R2927 = RES: 0402,0Ohm,+/-1%; Part Reference: R2927; CLASS: DISCRETE; RATING: 1/16W; Tolerance: 5%; MFG_NAME01: FENGHUA; MFG_PN01: RC-02000FT; CAD_APPROVED: Yes; FPLIST: RC0402_25,RC0402_HD,RC0402_X2,0402_CC; Value: 0R; HEIGHT: 0.45 MM; ROHS: Yes; VOLTAGE: 1/16W; PCB Footprint: R0402
R2928 = RES: 0201,10K,+/-5%; Part Reference: R2928; CLASS: DISCRETE; MFG_NAME01: FENGHUA; MFG_PN01: RC-01W103JT; CAD_APPROVED: Yes; FPLIST: RC0402_25,RC0402_HD,0402_CC; Value: 10K; ROHS: Yes; HEIGHT: 0.4 MM; PCB Footprint: R0201
R2929 = RES: 0402,0Ohm,+/-1%; Part Reference: R2929; CLASS: DISCRETE; RATING: 1/16W; FPLIST: RC0402_25,RC0402_HD,RC0402_X2,0402_CC; CAD_APPROVED: Yes; MFG_PN01: RC-02000FT; MFG_NAME01: FENGHUA; Tolerance: 5%; Value: 0R; HEIGHT: 0.45 MM; ROHS: Yes; VOLTAGE: 1/16W; PCB Footprint: R0402
R2930 = RES: 0603,62Ohm,+/-5%; Part Reference: R2930; CLASS: DISCRETE; MFG_PN01: RS-03K620JT; MFG_NAME01: FENGHUA; Temp Range: -55C to +155C; CAD_APPROVED: Yes; FPLIST: RC0603_OV,RC0603,0603_CC; Value: 62R; ROHS: Yes; HEIGHT: 0.55MM; PCB Footprint: R0603
R2931 = RES: 0201,0Ohm,+/-5%; Part Reference: R2931; CLASS: DISCRETE; VOLTAGE: 1/16W; FPLIST: RC0402_25,RC0402_HD,RC0402_X2,0402_CC; CAD_APPROVED: Yes; MFG_PN01: RC-01000JT; MFG_NAME01: FENGHUA; Tolerance: 5%; Value: 0R; ROHS: Yes; HEIGHT: 0.45 MM; PCB Footprint: R0201
R2932 = RES: 0201,10K,+/-5%; Part Reference: R2932; CLASS: DISCRETE; FPLIST: RC0402_25,RC0402_HD,0402_CC; CAD_APPROVED: Yes; MFG_PN01: RC-01W103JT; MFG_NAME01: FENGHUA; Tolerance: 5%; Value: 10K; HEIGHT: 0.4 MM; ROHS: Yes; PCB Footprint: R0201
R2965 = RES: 0201,100K,+/-1%; Part Reference: R2965; CLASS: DISCRETE; MFG_PN01: RC-01W1003FT; MFG_NAME01: FENGHUA; Temp Range: -55¡ãC ~ 155¡ãC; CAD_APPROVED: Yes; FPLIST: RC0402_25,RC0402_HD,0402_CC; Value: 100K; ROHS: Yes; HEIGHT: 0.4 MM; PCB Footprint: R0201
R2966 = RES: 0402,6.65K,+/-1%; Part Reference: R2966; CLASS: DISCRETE; FPLIST: RC0402_25,RC0402_HD,0402_CC; CAD_APPROVED: Yes; Temp Range: -55¡ãC ~ 155¡ãC; MFG_NAME01: FENGHUA; MFG_PN01: RC-02W6651FT; Value: 6.65K; HEIGHT: 0.4 MM; ROHS: Yes; PCB Footprint: R0402
R2967 = RES: 0201,10K,+/-5%; Part Reference: R2967; CLASS: DISCRETE; FPLIST: RC0402_25,RC0402_HD,0402_CC; CAD_APPROVED: Yes; MFG_PN01: RC-01W103JT; MFG_NAME01: FENGHUA; Value: 10K; HEIGHT: 0.4 MM; ROHS: Yes; PCB Footprint: R0201
R2969 = RES: 0201,10K,+/-5%; Part Reference: R2969; CLASS: DISCRETE; FPLIST: RC0402_25,RC0402_HD,0402_CC; CAD_APPROVED: Yes; MFG_PN01: RC-01W103JT; MFG_NAME01: FENGHUA; Value: 10K; HEIGHT: 0.4 MM; ROHS: Yes; PCB Footprint: R0201
R2970 = RES: 0201,0Ohm,+/-5%; Part Reference: R2970; CLASS: DISCRETE; VOLTAGE: 1/16W; FPLIST: RC0402_25,RC0402_HD,RC0402_X2,0402_CC; CAD_APPROVED: Yes; MFG_PN01: RC-01000JT; MFG_NAME01: FENGHUA; Tolerance: 5%; Value: 0R; ROHS: Yes; HEIGHT: 0.45 MM; PCB Footprint: R0201
R2972 = RES: 0201,0Ohm,+/-5%; Part Reference: R2972; CLASS: DISCRETE; Tolerance: 5%; MFG_NAME01: FENGHUA; MFG_PN01: RC-01000JT; CAD_APPROVED: Yes; FPLIST: RC0402_25,RC0402_HD,RC0402_X2,0402_CC; VOLTAGE: 1/16W; Value: 0R; HEIGHT: 0.45 MM; ROHS: Yes; PCB Footprint: R0201
R2973 = RES: 0201,0Ohm,+/-5%; Part Reference: R2973; CLASS: DISCRETE; Tolerance: 5%; MFG_NAME01: FENGHUA; MFG_PN01: RC-01000JT; CAD_APPROVED: Yes; FPLIST: RC0402_25,RC0402_HD,RC0402_X2,0402_CC; VOLTAGE: 1/16W; Value: 0R; HEIGHT: 0.45 MM; ROHS: Yes; PCB Footprint: R0201
R2974 = RES: 0201,0Ohm,+/-5%; Part Reference: R2974; CLASS: DISCRETE; Tolerance: 5%; MFG_NAME01: FENGHUA; MFG_PN01: RC-01000JT; CAD_APPROVED: Yes; FPLIST: RC0402_25,RC0402_HD,RC0402_X2,0402_CC; VOLTAGE: 1/16W; Value: 0R; HEIGHT: 0.45 MM; ROHS: Yes; PCB Footprint: R0201
R2975 = RES: 0201,0Ohm,+/-5%; Part Reference: R2975; CLASS: DISCRETE; Tolerance: 5%; MFG_NAME01: FENGHUA; MFG_PN01: RC-01000JT; CAD_APPROVED: Yes; FPLIST: RC0402_25,RC0402_HD,RC0402_X2,0402_CC; VOLTAGE: 1/16W; Value: 0R; HEIGHT: 0.45 MM; ROHS: Yes; PCB Footprint: R0201
R2976 = R0402,10K: 0402,330Ohm,+/-1%; Part Reference: R2976; serial number: 1110102037; precision: ¡À1£¥; MFG_NAME01: FENGHUA; MFG_PN01: RC-02W3300FT; PCB Footprint: R0402; Value: 330R
R2977 = R0402,10K: 0402,0Ohm,+/-1%; Part Reference: R2977; serial number: 1110102037; precision: ¡À1£¥; MFG_NAME01: FENGHUA; MFG_PN01: RC-02000FT; PCB Footprint: R0402; Value: 0R
R2978 = R0402,10K: 0402,1K,+/-1%; Part Reference: R2978; serial number: 1110102037; precision: ¡À1£¥; MFG_NAME01: FENGHUA; MFG_PN01: RC-02K1001FT; PCB Footprint: R0402; Value: 1K
R2979 = R0402,10K: 0201,10K,+/-5%; Part Reference: R2979; serial number: 1110102037; precision: ¡À1£¥; MFG_NAME01: FENGHUA; MFG_PN01: RC-01W103JT; PCB Footprint: R0201; Value: 10K
R2980 = R0402,10K: 0201,10K,+/-5%; Part Reference: R2980; serial number: 1110102037; precision: ¡À1£¥; MFG_NAME01: FENGHUA; MFG_PN01: RC-01W103JT; PCB Footprint: R0201; Value: 10K
R2981 = R0402,10K: 0201,10K,+/-5%; Part Reference: R2981; serial number: 1110102037; precision: ¡À1£¥; MFG_NAME01: FENGHUA; MFG_PN01: RC-01W103JT; PCB Footprint: R0201; Value: 10K
R2982 = R0402,10K: 0201,10K,+/-5%; Part Reference: R2982; serial number: 1110102037; precision: ¡À1£¥; MFG_NAME01: FENGHUA; MFG_PN01: RC-01W103JT; PCB Footprint: R0201; Value: 10K
R2983 = R0402,10K: 0201,10K,+/-5%; Part Reference: R2983; serial number: 1110102037; precision: ¡À1£¥; MFG_NAME01: FENGHUA; MFG_PN01: RC-01W103JT; PCB Footprint: R0201; Value: 10K
R2984 = R0402,0R: 0201,0Ohm,+/-5%; Part Reference: R2984; serial number: 1110102001; MFG_NAME01: FENGHUA; MFG_PN01: RC-01000JT; PCB Footprint: R0201; Value: 0R
R2985 = R0402,10K: 0201,10K,+/-5%; Part Reference: R2985; serial number: 1110102037; precision: ¡À1£¥; MFG_NAME01: FENGHUA; MFG_PN01: RC-01W103JT; PCB Footprint: R0201; Value: 10K
R2986 = R0402,10K: 0201,10K,+/-5%; Part Reference: R2986; serial number: 1110102037; precision: ¡À1£¥; MFG_NAME01: FENGHUA; MFG_PN01: RC-01W103JT; PCB Footprint: R0201; Value: 10K
R2987 = R0402,0R: 0201,0Ohm,+/-5%; Part Reference: R2987; serial number: 1110102001; MFG_NAME01: FENGHUA; MFG_PN01: RC-01000JT; PCB Footprint: R0201; Value: 0R
SW3 = SW_SMT_1: 2bit,4P,1.27mm,black; Part Reference: SW3; MFG_NAME01: KE; MFG_PN01: 2bit-4P-1.27mm; Value: SW_SMT_2; PCB Footprint: SW_SMT_4
SW4 = SW-SPST_A: 1bit,2P,1.27mm,black; Part Reference: SW4; CLASS: IC; 3D_Mechanical_Footprint_File: ftp://fcl.am.freescale.net/ALLEGRO/step/sw_2p8x5p7_sm.step; MFG_PN01: 1bit-2P-1.27mm; MFG_NAME01: KE; Temp Range: -40C ~ 85C; CAD_APPROVED: Yes; Value: SW_SMT_1; ROHS: Yes; HEIGHT: 2.5MM; PCB Footprint: sw_2p8x5p4_sm
TP1015 = TESTLOOP: no part to order; Part Reference: TP1015; CLASS: IO; ASSY_OPT: DNP; MFG_NAME01: NOT A COMPONENT; CAD_APPROVED: Yes; MFG_PN01: NOT A COMPONENT; ROHS: Yes; HEIGHT: 0.1MM; PCB Footprint: tpad_015
TP1016 = TESTLOOP: no part to order; Part Reference: TP1016; CLASS: IO; ASSY_OPT: DNP; MFG_NAME01: NOT A COMPONENT; CAD_APPROVED: Yes; MFG_PN01: NOT A COMPONENT; ROHS: Yes; HEIGHT: 0.1MM; PCB Footprint: tpad_015
TP1017 = TESTLOOP: no part to order; Part Reference: TP1017; CLASS: IO; ASSY_OPT: DNP; CAD_APPROVED: Yes; MFG_PN01: NOT A COMPONENT; HEIGHT: 0.1MM; ROHS: Yes; MFG_NAME01: NOT A COMPONENT; PCB Footprint: tpad_015
TP1018 = TESTLOOP: no part to order; Part Reference: TP1018; CLASS: IO; ASSY_OPT: DNP; CAD_APPROVED: Yes; MFG_PN01: NOT A COMPONENT; HEIGHT: 0.1MM; ROHS: Yes; MFG_NAME01: NOT A COMPONENT; PCB Footprint: tpad_015
TP1042 = T POINT R: no part to order; Part Reference: TP1042; CLASS: IC; MFG_PN01: NOT A COMPONENT; CAD_APPROVED: Yes; MFG_NAME01: NOT A COMPONENT; ROHS: Yes; HEIGHT: 0.1MM; PCB Footprint: tpad_020
TP1043 = T POINT R: no part to order; Part Reference: TP1043; ASSY_OPT: DNP; CLASS: IC; CAD_APPROVED: Yes; MFG_NAME01: NOT A COMPONENT; HEIGHT: 0.1MM; ROHS: Yes; MFG_PN01: NOT A COMPONENT; PCB Footprint: tpad_020
TP1046 = T POINT R: no part to order; Part Reference: TP1046; CLASS: IC; MFG_PN01: NOT A COMPONENT; CAD_APPROVED: Yes; MFG_NAME01: NOT A COMPONENT; ROHS: Yes; HEIGHT: 0.1MM; PCB Footprint: tpad_020
TP1083 = T POINT R: no part to order; Part Reference: TP1083; ASSY_OPT: DNP; CLASS: IC; CAD_APPROVED: Yes; MFG_NAME01: NOT A COMPONENT; HEIGHT: 0.1MM; ROHS: Yes; MFG_PN01: NOT A COMPONENT; PCB Footprint: tpad_020
TP1084 = T POINT R: no part to order; Part Reference: TP1084; ASSY_OPT: DNP; CLASS: IC; MFG_PN01: NOT A COMPONENT; CAD_APPROVED: Yes; MFG_NAME01: NOT A COMPONENT; ROHS: Yes; HEIGHT: 0.1MM; PCB Footprint: tpad_020
TP1085 = T POINT R: no part to order; Part Reference: TP1085; ASSY_OPT: DNP; CLASS: IC; CAD_APPROVED: Yes; MFG_NAME01: NOT A COMPONENT; HEIGHT: 0.1MM; ROHS: Yes; MFG_PN01: NOT A COMPONENT; PCB Footprint: tpad_020
TP1086 = T POINT R: no part to order; Part Reference: TP1086; ASSY_OPT: DNP; CLASS: IC; CAD_APPROVED: Yes; MFG_NAME01: NOT A COMPONENT; HEIGHT: 0.1MM; ROHS: Yes; MFG_PN01: NOT A COMPONENT; PCB Footprint: tpad_020
U734 = CH342F: Part Reference: U734; MFG_NAME01: WCH; Value: CH342F; MFG_PN01: CH342F; PCB Footprint: QFN24P_0_5
U735 = PESD1USB30_5P: IC EMI FILTER ESD PROTECTION 15kV/LINE WLCSP5; Manufacturer: NXP Semiconductors; Part Reference: U735; MFG_PN01: PCMF1USB3SZ; MFG_NAME01: NEXPERIA; CAD_APPROVED: Yes; Manufacturer Part Number: PESD1USB30; CLASS: IC; Value: PCMF1USB3S; 3D_Mechanical_Footprint_File: http://fcl.am.freescale.net/ALLEGRO/step/wlcsp5_0p4_0p82x1p22.STEP; ROHS: Yes; HEIGHT: 0.6MM; PCB Footprint: wlcsp5_0p4_0p82x1p22
U736 = PESD1USB30_5P: IC EMI FILTER ESD PROTECTION 15kV/LINE WLCSP5; Manufacturer: NXP Semiconductors; Part Reference: U736; MFG_PN01: PCMF1USB3SZ; MFG_NAME01: NEXPERIA; CAD_APPROVED: Yes; Manufacturer Part Number: PESD1USB30; CLASS: IC; Value: PCMF1USB3S; 3D_Mechanical_Footprint_File: http://fcl.am.freescale.net/ALLEGRO/step/wlcsp5_0p4_0p82x1p22.STEP; ROHS: Yes; HEIGHT: 0.6MM; PCB Footprint: wlcsp5_0p4_0p82x1p22
U737 = SGM2034-3_1.3YN3G: TLV76033DBZR,SOT23-3,Fixed output linear voltage regulator, up to 30V input, 100mA output, 3.3V output; Part Reference: U737; MFG_NAME01: Nexperia; Value: TLV76033DBZR; MFG_PN01: TLV76033DBZR; PCB Footprint: sot23_a
U738 = SN74AVC4T245RSVR: SN74AVC4T245RSVR,UQFN16_2.6x1.8mm; Part Reference: U738; MFG_NAME01: TI; Value: SN74AVC4T245RSVR; MFG_PN01: SN74AVC4T245RSVR; PCB Footprint: UQFN16_26x18
U740 = PCF2131_4: PCF2131TF,HLSON16,Nano-power highly accurate RTC with integrated quartz crystal; Part Reference: U740; CLASS: IC; CAD_APPROVED: Yes; MFG_NAME01: Nexperia; Value: PCF2131; HEIGHT: 1.75MM; ROHS: Yes; MFG_PN01: PCF2131TF; PCB Footprint: so16_0p5_3p5x4p5_mm
U741 = TJA1051T/3: TJA1051T/3,SO8; Part Reference: U741; MFG_NAME01: NXP SEMICONDUCTORS; Value: TJA1051T/3; MFG_PN01: TJA1051T/3; PCB Footprint: SOP8_1_27
U742 = SGM2526_3: SGM2526YTD10G/TR,TDFN-3x3-10L,-40+C~85+C,Imax 5A; Part Reference: U742; MFG_NAME01: SGMICRO; Value: SGM2526; MFG_PN01: SGM2526; PCB Footprint: tdfn_3x3_10l

## Sheet X-22 NOTE.SchDoc: FRDM-IMX93
size 513 x 386 mm; DrawnBy: FORLINX; Organization: ORGANIZATION; Address1: ADDRESS 1; Address2: ADDRESS 2; Address3: ADDRESS 3; Address4: ADDRESS 4; Revision: -; ENG_APP_DATE: --/--/--; DSN_APP_DATE: --/--/--; CHK_APP_DATE: --/--/--; Classification: Public, Company Internal/Proprietary, Company Confidential,  Company Secret; Page Create Date: March  8, 1995; OrgName: NXP Semiconductor; FIUO: A; OrgAddr1: NO. 192 Liangjing Rd. Pudong New Area, ShangHai; Page Number: 22; PageTitle: NOTE; Page Size: C; Comment: TitleBlock_MCPG; Page Count: 23; Designer: FORLINX; RevCode: B1; Approver: NXP SE; Doc: SCH-94611 PDF: SPF-94611; DsnPath: T:\FILES\Designs\Single Board Computers\i.MX93-FRDM\Design Files\SCH-94611_B1.DSN; SchematicName: FRDM-i.MX 93 Development Board; PageName: X-22 NOTE; PageSize: C; TopSchematic: True
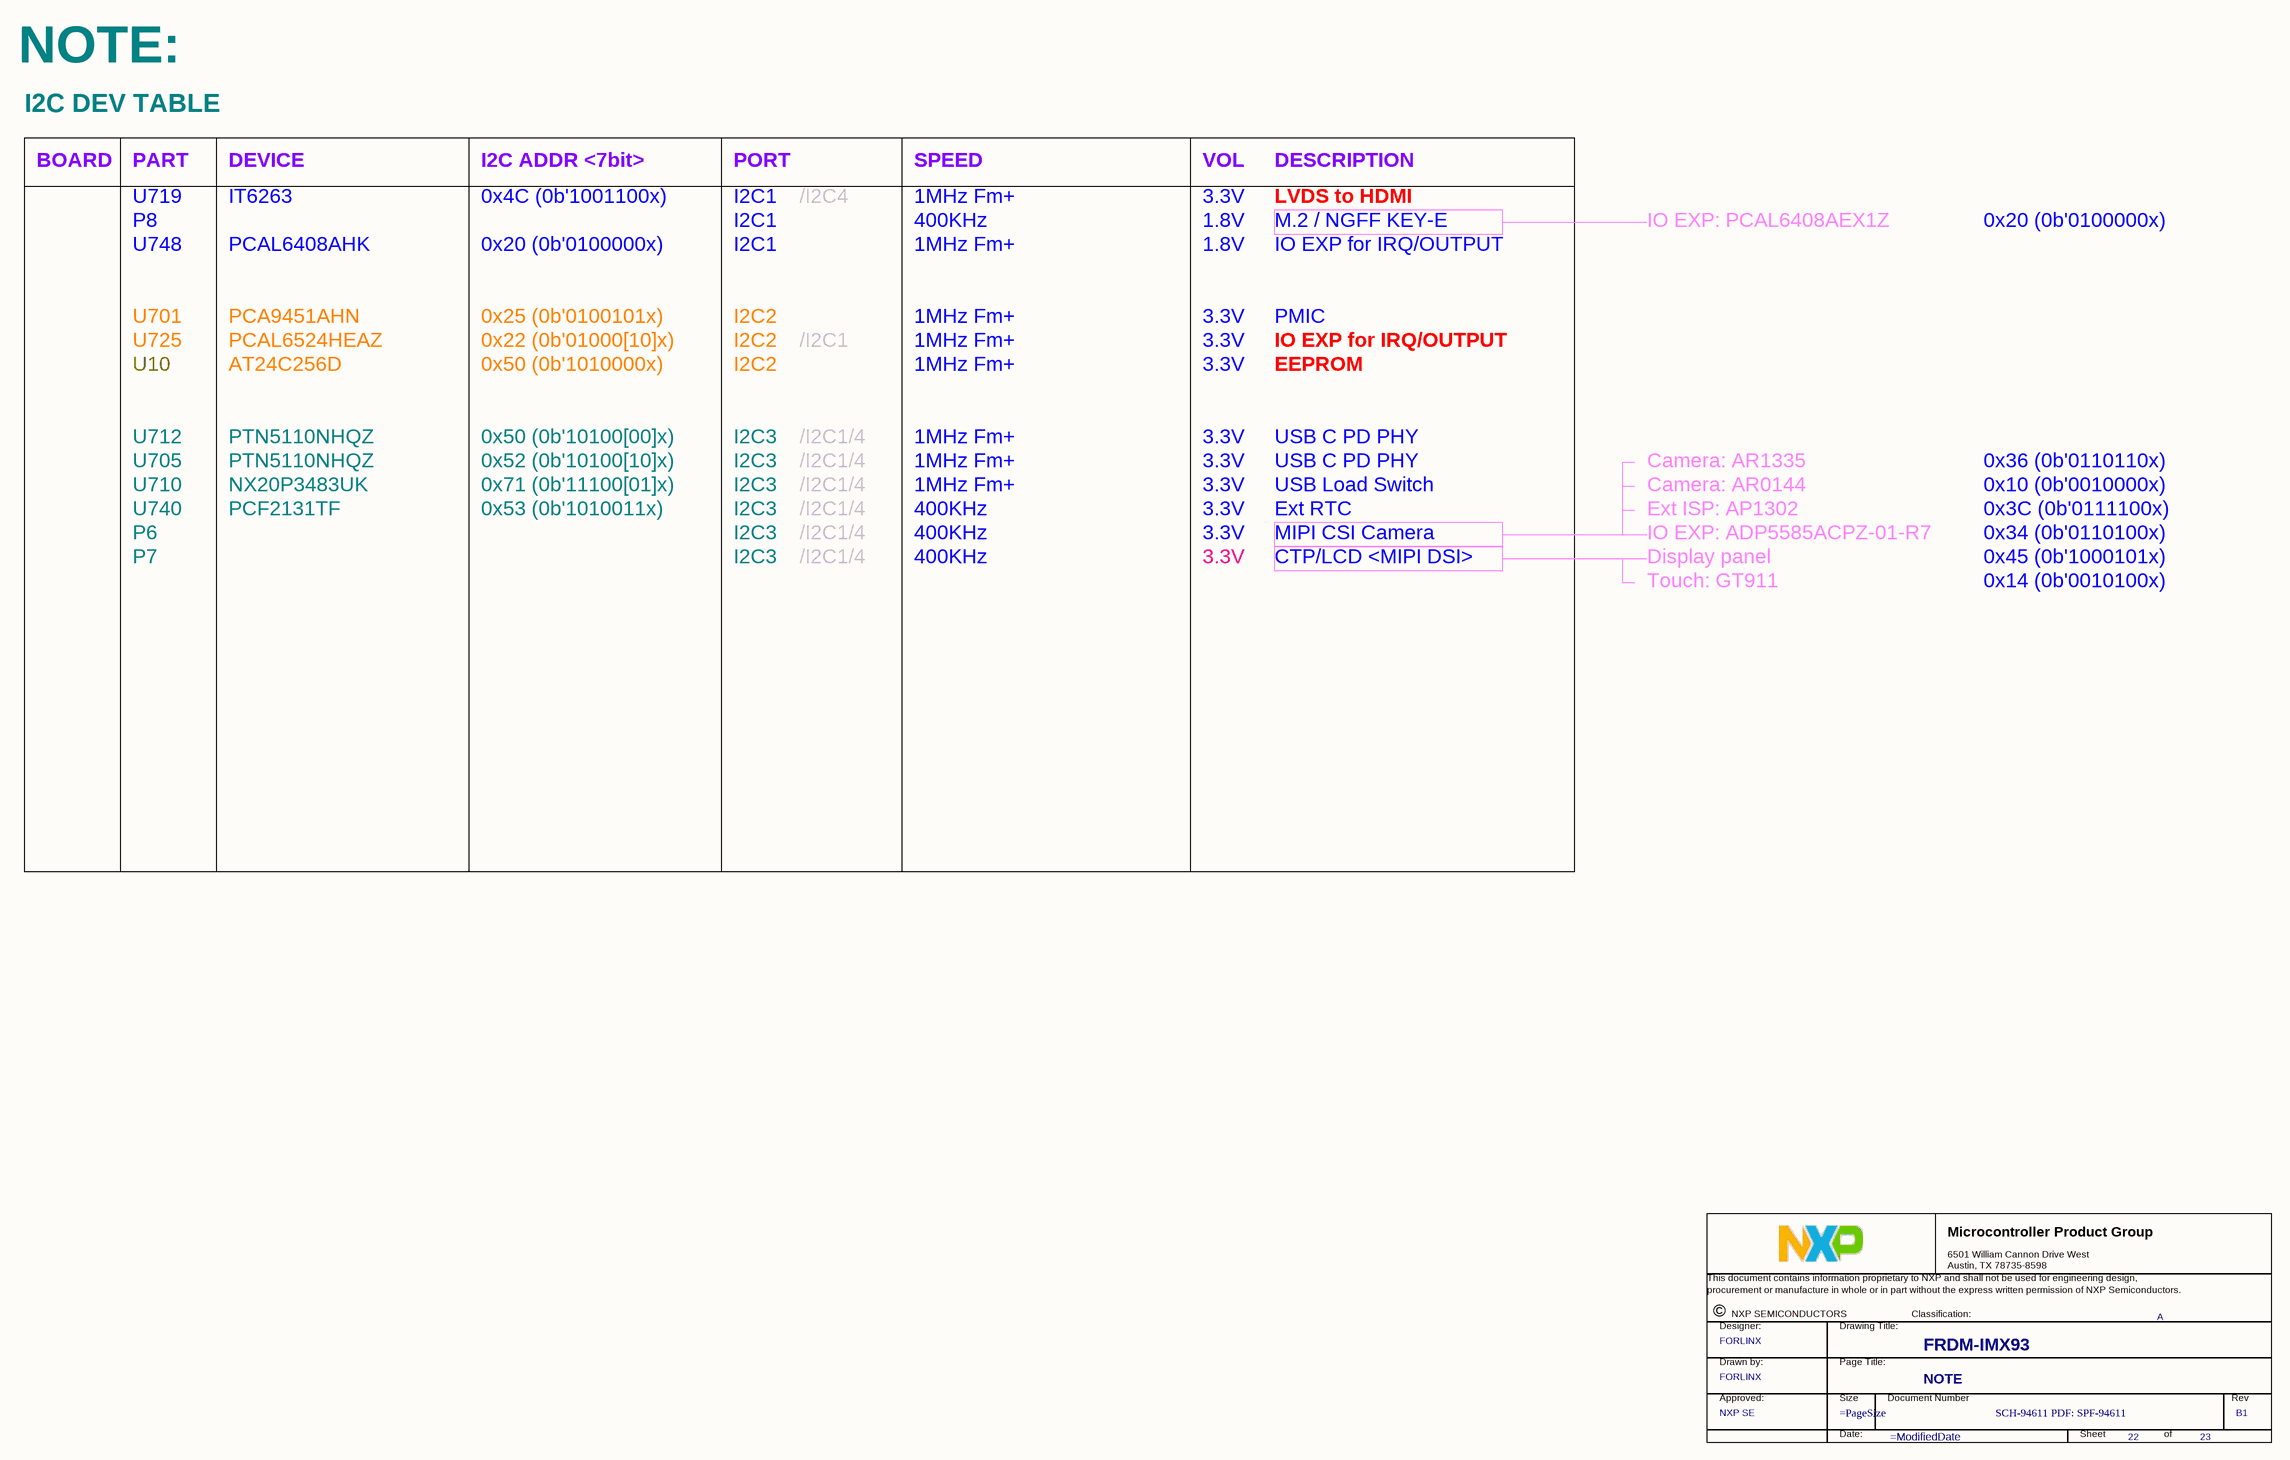
[diagram p39: X-22 NOTE.SchDoc]

### Parts
(Parts that share a designator on the sheet are numbered #1, #2 ... from top to bottom, then left to right.)
*#22  Title: FRDM-IMX93  RevCode: B1  PageTitle: NOTE  Page Number: 22  Page Count: 23  DrawnBy: FORLINX  Doc: SCH-94611 PDF: SPF-94611  Approver: NXP SE  FIUO: A  (hidden comment: TitleBlock_MCPG)  (graphical)

### Notes on the sheet
- NOTE:
- I2C DEV TABLE
- BOARD
- U719
- PART
- DEVICE
- IT6263
- 0x4C (0b'1001100x)
- I2C ADDR <7bit>
- PORT
- I2C1
- /I2C4
- SPEED
- 1MHz Fm+
- 3.3V
- VOL
- DESCRIPTION
- LVDS to HDMI
- U748
- P8
- PCAL6408AHK
- 0x20 (0b'0100000x)
- 400KHz
- 1.8V
- IO EXP for IRQ/OUTPUT
- M.2 / NGFF KEY-E
- IO EXP: PCAL6408AEX1Z
- U701
- PCA9451AHN
- 0x25 (0b'0100101x)
- I2C2
- PMIC
- U725
- U10
- PCAL6524HEAZ
- AT24C256D
- 0x22 (0b'01000[10]x)
- 0x50 (0b'1010000x)
- /I2C1
- EEPROM
- U712
- PTN5110NHQZ
- 0x50 (0b'10100[00]x)
- I2C3
- /I2C1/4
- USB C PD PHY
- U710
- U740
- U705
- PCF2131TF
- NX20P3483UK
- 0x53 (0b'1010011x)
- 0x52 (0b'10100[10]x)
- 0x71 (0b'11100[01]x)
- Ext RTC
- USB Load Switch
- Camera: AR0144
- Camera: AR1335
- Ext ISP: AP1302
- 0x3C (0b'0111100x)
- 0x10 (0b'0010000x)
- 0x36 (0b'0110110x)
- P6
- P7
- CTP/LCD <MIPI DSI>
- MIPI CSI Camera
- IO EXP: ADP5585ACPZ-01-R7
- Display panel
- 0x45 (0b'1000101x)
- 0x34 (0b'0110100x)
- Touch: GT911
- 0x14 (0b'0010100x)
- DWG. NO.
- REV.
- SHT.
- REVISION
- DATE
- APPROVED
- ENG:
- APPROVALS
- quilter.ai <http://quilter.ai>
- DSN:
- CHK:
- REFERENCE DOCUMENTS
- TITLE
- PROJECT
- BOM:
- FAB DWG:
- PCB DWG:
- ASSY DWG:
- SIZE
- FILE NAME
- C
- DWG NO.
- SHEET
- OF
- REV
- (in symbol TitleBlock_MCPG) Microcontroller Product Group; 6501 William Cannon Drive West / Austin, TX 78735-8598; This document contains information proprietary to NXP and shall not be used for engineering design,; procurement or manufacture in whole or in part without the express written permission of NXP Semiconductors.; ©; NXP SEMICONDUCTORS; Classification:; Designer:; Drawing Title:; Drawn by:; Page Title:; Approved:; Size; Document Number; Rev; Date:; Sheet; of

### Library data of the parts
*#22 = TitleBlock_MCPG: Classification: Public, Company Internal/Proprietary, Company Confidential,  Company Secret; OrgName: NXP Semiconductor; OrgAddr1: NO. 192 Liangjing Rd. Pudong New Area, ShangHai; Page Size: =PageSize; Page Create Date: March  8, 1995; Designer: FORLINX; Page Modify Date: =ModifiedDate

## Sheet X-23 IOMUX.SchDoc: FRDM-IMX93
size 513 x 436 mm; DrawnBy: FORLINX; Organization: ORGANIZATION; Address1: ADDRESS 1; Address2: ADDRESS 2; Address3: ADDRESS 3; Address4: ADDRESS 4; Revision: -; ENG_APP_DATE: --/--/--; DSN_APP_DATE: --/--/--; CHK_APP_DATE: --/--/--; Classification: Public, Company Internal/Proprietary, Company Confidential,  Company Secret; Page Create Date: March  8, 1995; OrgName: NXP Semiconductor; FIUO: A; OrgAddr1: NO. 192 Liangjing Rd. Pudong New Area, ShangHai; Page Number: 23; PageTitle: IOMUX; Page Size: Custom; Comment: TitleBlock_MCPG; Page Count: 23; Designer: FORLINX; RevCode: B1; Approver: NXP SE; Doc: SCH-94611 PDF: SPF-94611; DsnPath: T:\FILES\Designs\Single Board Computers\i.MX93-FRDM\Design Files\SCH-94611_B1.DSN; SchematicName: FRDM-i.MX 93 Development Board; PageName: X-23 IOMUX; PageSize: Custom; TopSchematic: True
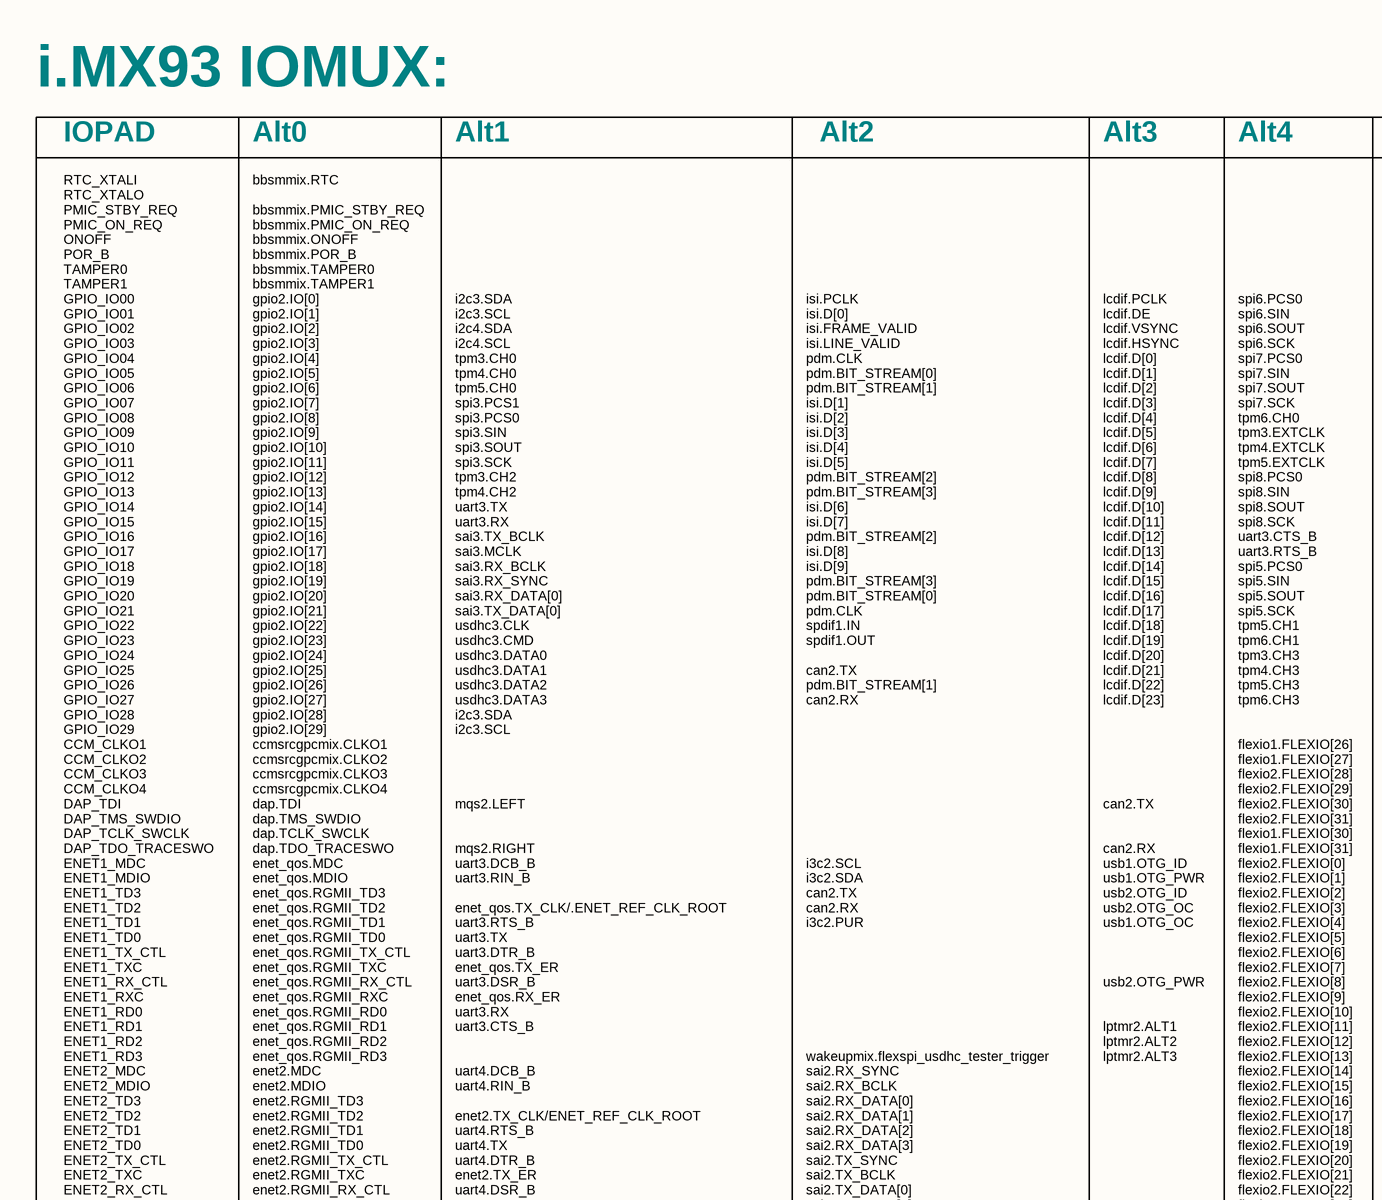
[diagram p40: X-23 IOMUX.SchDoc, top left]
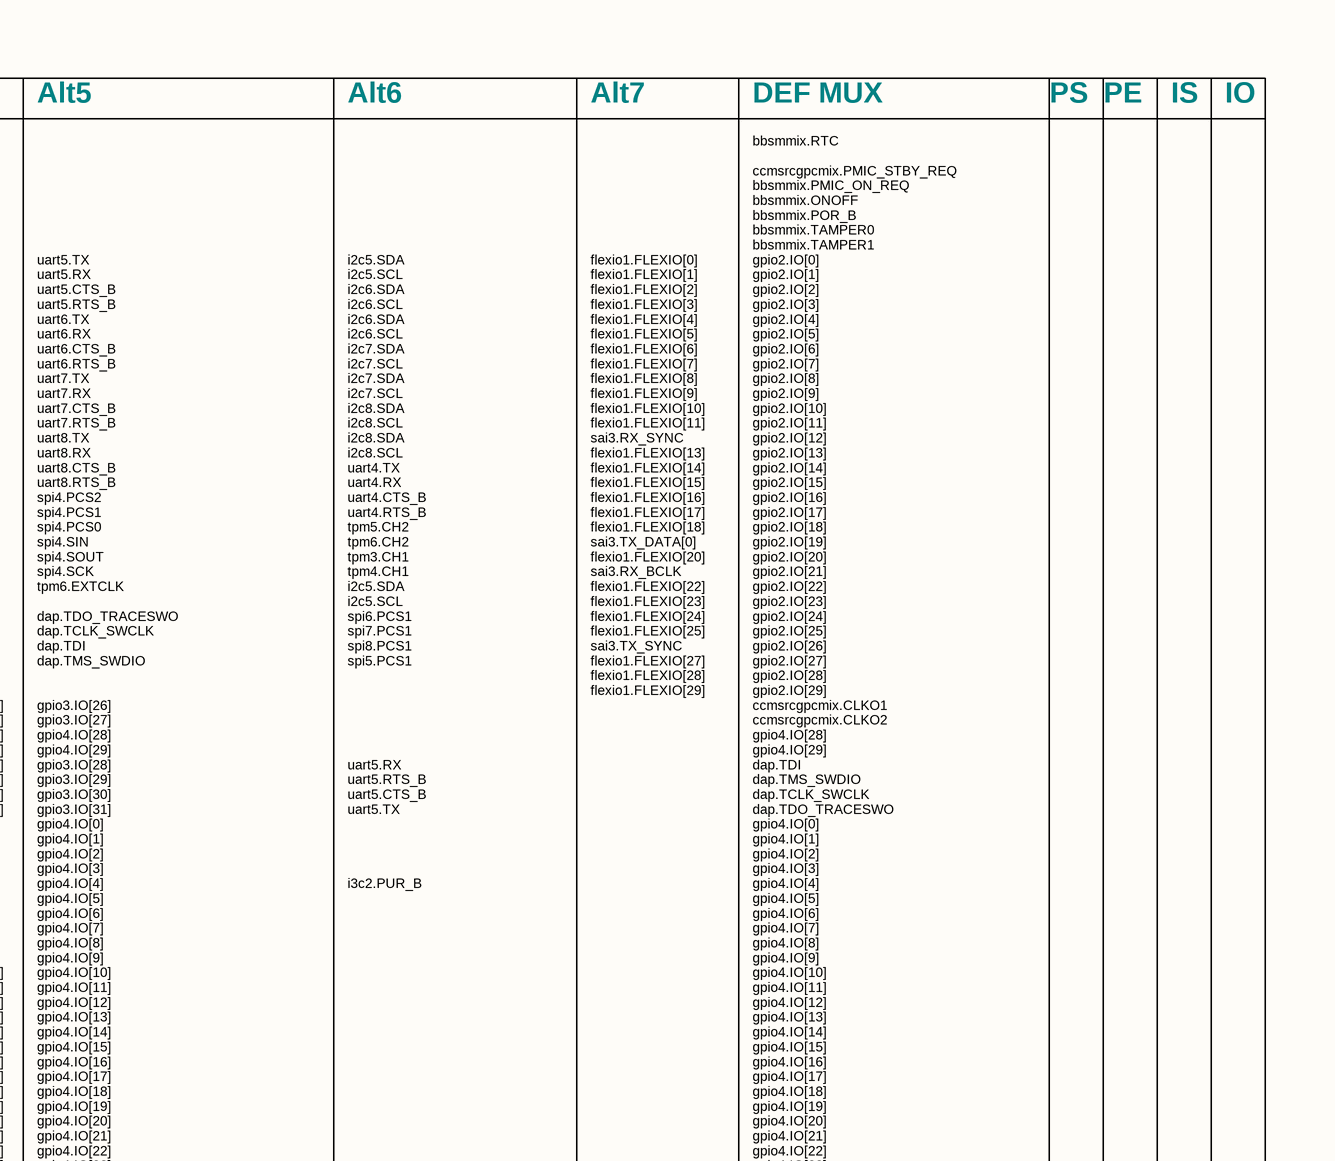
[diagram p41: X-23 IOMUX.SchDoc, top right]
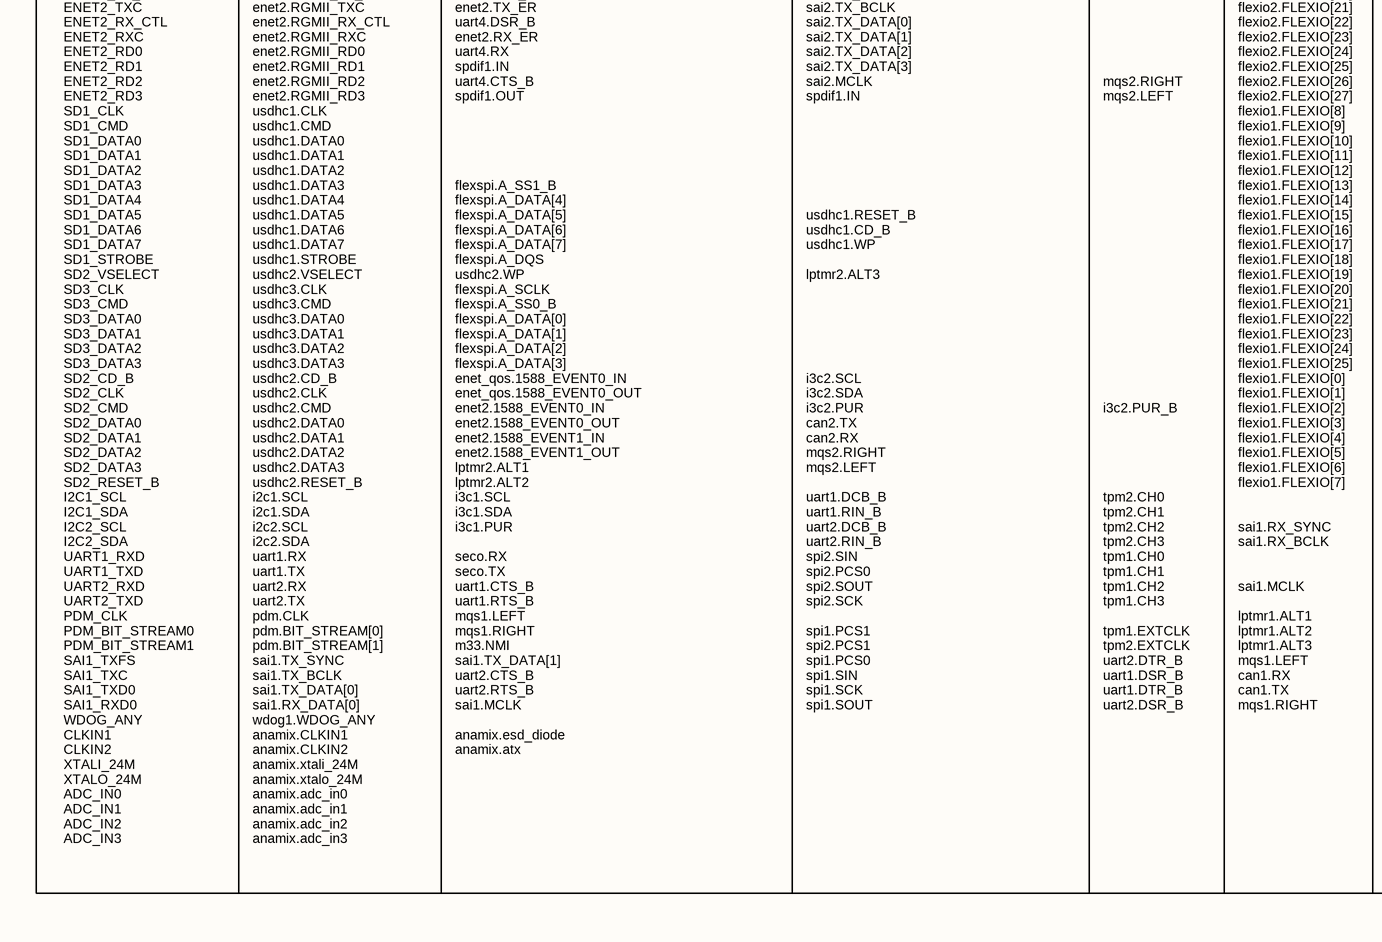
[diagram p42: X-23 IOMUX.SchDoc, bottom left]
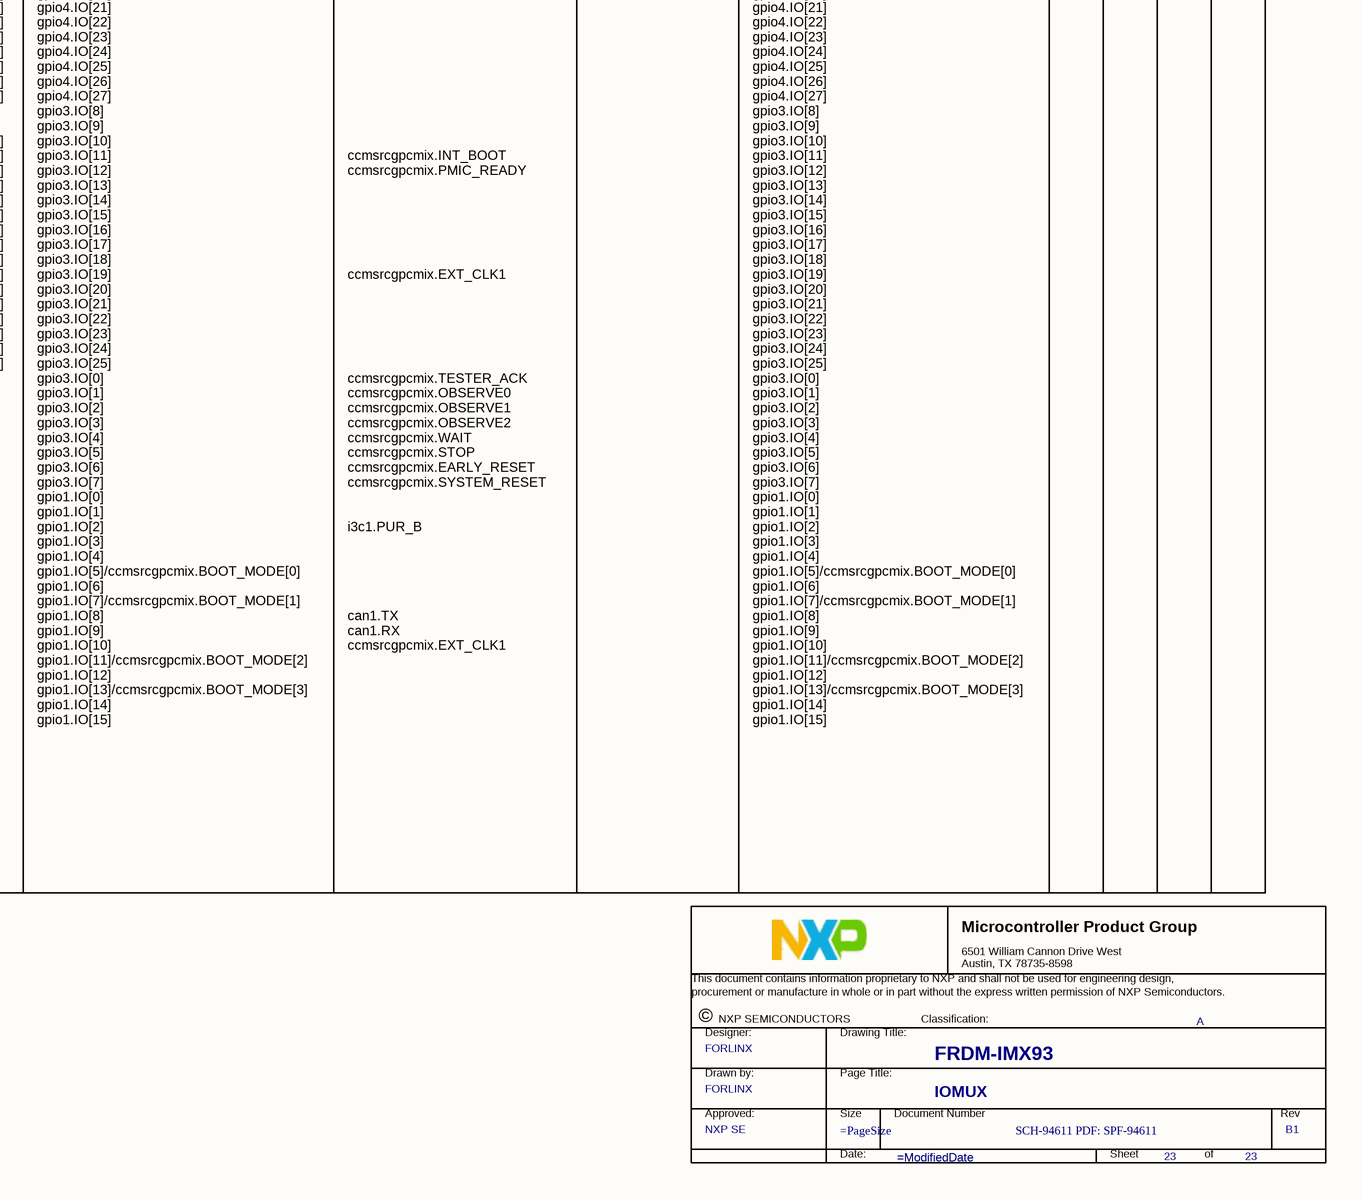
[diagram p43: X-23 IOMUX.SchDoc, bottom right]

### Parts
(Parts that share a designator on the sheet are numbered #1, #2 ... from top to bottom, then left to right.)
*#23  Title: FRDM-IMX93  RevCode: B1  PageTitle: IOMUX  Page Number: 23  DrawnBy: FORLINX  Doc: SCH-94611 PDF: SPF-94611  Approver: NXP SE  FIUO: A  (hidden comment: TitleBlock_MCPG)  (graphical)

### Notes on the sheet
- i.MX93 IOMUX:
- IOPAD
- Alt0
- Alt1
- Alt2
- Alt3
- Alt4
- Alt5
- Alt6
- Alt7
- DEF MUX
- PS
- PE
- IS
- IO
- bbsmmix.RTC
  ccmsrcgpcmix.PMIC_STBY_REQ
  bbsmmix.PMIC_ON_REQ
  bbsmmix.ONOFF
  bbsmmix.POR_B
  bbsmmix.TAMPER0
  bbsmmix.TAMPER1
  gpio2.IO[0]
  gpio2.IO[1]
  gpio2.IO[2]
  gpio2.IO[3]
  gpio2.IO[4]
  gpio2.IO[5]
  gpio2.IO[6]
  gpio2.IO[7]
  gpio2.IO[8]
  gpio2.IO[9]
  gpio2.IO[10]
  gpio2.IO[11]
  gpio2.IO[12]
  gpio2.IO[13]
  gpio2.IO[14]
  gpio2.IO[15]
  gpio2.IO[16]
  gpio2.IO[17]
  gpio2.IO[18]
  gpio2.IO[19]
  gpio2.IO[20]
  gpio2.IO[21]
  gpio2.IO[22]
  gpio2.IO[23]
  gpio2.IO[24]
  gpio2.IO[25]
  gpio2.IO[26]
  gpio2.IO[27]
  gpio2.IO[28]
  gpio2.IO[29]
  ccmsrcgpcmix.CLKO1
  ccmsrcgpcmix.CLKO2
  gpio4.IO[28]
  gpio4.IO[29]
  dap.TDI
  dap.TMS_SWDIO
  dap.TCLK_SWCLK
  dap.TDO_TRACESWO
  gpio4.IO[0]
  gpio4.IO[1]
  gpio4.IO[2]
  gpio4.IO[3]
  gpio4.IO[4]
  gpio4.IO[5]
  gpio4.IO[6]
  gpio4.IO[7]
  gpio4.IO[8]
  gpio4.IO[9]
  gpio4.IO[10]
  gpio4.IO[11]
  gpio4.IO[12]
  gpio4.IO[13]
  gpio4.IO[14]
  gpio4.IO[15]
  gpio4.IO[16]
  gpio4.IO[17]
  gpio4.IO[18]
  gpio4.IO[19]
  gpio4.IO[20]
  gpio4.IO[21]
  gpio4.IO[22]
  gpio4.IO[23]
  gpio4.IO[24]
  gpio4.IO[25]
  gpio4.IO[26]
  gpio4.IO[27]
  gpio3.IO[8]
  gpio3.IO[9]
  gpio3.IO[10]
  gpio3.IO[11]
  gpio3.IO[12]
  gpio3.IO[13]
  gpio3.IO[14]
  gpio3.IO[15]
  gpio3.IO[16]
  gpio3.IO[17]
  gpio3.IO[18]
  gpio3.IO[19]
  gpio3.IO[20]
  gpio3.IO[21]
  gpio3.IO[22]
  gpio3.IO[23]
  gpio3.IO[24]
  gpio3.IO[25]
  gpio3.IO[0]
  gpio3.IO[1]
  gpio3.IO[2]
  gpio3.IO[3]
  gpio3.IO[4]
  gpio3.IO[5]
  gpio3.IO[6]
  gpio3.IO[7]
  gpio1.IO[0]
  gpio1.IO[1]
  gpio1.IO[2]
  gpio1.IO[3]
  gpio1.IO[4]
  gpio1.IO[5]/ccmsrcgpcmix.BOOT_MODE[0]
  gpio1.IO[6]
  gpio1.IO[7]/ccmsrcgpcmix.BOOT_MODE[1]
  gpio1.IO[8]
  gpio1.IO[9]
  gpio1.IO[10]
  gpio1.IO[11]/ccmsrcgpcmix.BOOT_MODE[2]
  gpio1.IO[12]
  gpio1.IO[13]/ccmsrcgpcmix.BOOT_MODE[3]
  gpio1.IO[14]
  gpio1.IO[15]
- RTC_XTALI
  RTC_XTALO
  PMIC_STBY_REQ
  PMIC_ON_REQ
  ONOFF
  POR_B
  TAMPER0
  TAMPER1
  GPIO_IO00
  GPIO_IO01
  GPIO_IO02
  GPIO_IO03
  GPIO_IO04
  GPIO_IO05
  GPIO_IO06
  GPIO_IO07
  GPIO_IO08
  GPIO_IO09
  GPIO_IO10
  GPIO_IO11
  GPIO_IO12
  GPIO_IO13
  GPIO_IO14
  GPIO_IO15
  GPIO_IO16
  GPIO_IO17
  GPIO_IO18
  GPIO_IO19
  GPIO_IO20
  GPIO_IO21
  GPIO_IO22
  GPIO_IO23
  GPIO_IO24
  GPIO_IO25
  GPIO_IO26
  GPIO_IO27
  GPIO_IO28
  GPIO_IO29
  CCM_CLKO1
  CCM_CLKO2
  CCM_CLKO3
  CCM_CLKO4
  DAP_TDI
  DAP_TMS_SWDIO
  DAP_TCLK_SWCLK
  DAP_TDO_TRACESWO
  ENET1_MDC
  ENET1_MDIO
  ENET1_TD3
  ENET1_TD2
  ENET1_TD1
  ENET1_TD0
  ENET1_TX_CTL
  ENET1_TXC
  ENET1_RX_CTL
  ENET1_RXC
  ENET1_RD0
  ENET1_RD1
  ENET1_RD2
  ENET1_RD3
  ENET2_MDC
  ENET2_MDIO
  ENET2_TD3
  ENET2_TD2
  ENET2_TD1
  ENET2_TD0
  ENET2_TX_CTL
  ENET2_TXC
  ENET2_RX_CTL
  ENET2_RXC
  ENET2_RD0
  ENET2_RD1
  ENET2_RD2
  ENET2_RD3
  SD1_CLK
  SD1_CMD
  SD1_DATA0
  SD1_DATA1
  SD1_DATA2
  SD1_DATA3
  SD1_DATA4
  SD1_DATA5
  SD1_DATA6
  SD1_DATA7
  SD1_STROBE
  SD2_VSELECT
  SD3_CLK
  SD3_CMD
  SD3_DATA0
  SD3_DATA1
  SD3_DATA2
  SD3_DATA3
  SD2_CD_B
  SD2_CLK
  SD2_CMD
  SD2_DATA0
  SD2_DATA1
  SD2_DATA2
  SD2_DATA3
  SD2_RESET_B
  I2C1_SCL
  I2C1_SDA
  I2C2_SCL
  I2C2_SDA
  UART1_RXD
  UART1_TXD
  UART2_RXD
  UART2_TXD
  PDM_CLK
  PDM_BIT_STREAM0
  PDM_BIT_STREAM1
  SAI1_TXFS
  SAI1_TXC
  SAI1_TXD0
  SAI1_RXD0
  WDOG_ANY
  CLKIN1
  CLKIN2
  XTALI_24M
  XTALO_24M
  ADC_IN0
  ADC_IN1
  ADC_IN2
  ADC_IN3
- bbsmmix.RTC
  bbsmmix.PMIC_STBY_REQ
  bbsmmix.PMIC_ON_REQ
  bbsmmix.ONOFF
  bbsmmix.POR_B
  bbsmmix.TAMPER0
  bbsmmix.TAMPER1
  gpio2.IO[0]
  gpio2.IO[1]
  gpio2.IO[2]
  gpio2.IO[3]
  gpio2.IO[4]
  gpio2.IO[5]
  gpio2.IO[6]
  gpio2.IO[7]
  gpio2.IO[8]
  gpio2.IO[9]
  gpio2.IO[10]
  gpio2.IO[11]
  gpio2.IO[12]
  gpio2.IO[13]
  gpio2.IO[14]
  gpio2.IO[15]
  gpio2.IO[16]
  gpio2.IO[17]
  gpio2.IO[18]
  gpio2.IO[19]
  gpio2.IO[20]
  gpio2.IO[21]
  gpio2.IO[22]
  gpio2.IO[23]
  gpio2.IO[24]
  gpio2.IO[25]
  gpio2.IO[26]
  gpio2.IO[27]
  gpio2.IO[28]
  gpio2.IO[29]
  ccmsrcgpcmix.CLKO1
  ccmsrcgpcmix.CLKO2
  ccmsrcgpcmix.CLKO3
  ccmsrcgpcmix.CLKO4
  dap.TDI
  dap.TMS_SWDIO
  dap.TCLK_SWCLK
  dap.TDO_TRACESWO
  enet_qos.MDC
  enet_qos.MDIO
  enet_qos.RGMII_TD3
  enet_qos.RGMII_TD2
  enet_qos.RGMII_TD1
  enet_qos.RGMII_TD0
  enet_qos.RGMII_TX_CTL
  enet_qos.RGMII_TXC
  enet_qos.RGMII_RX_CTL
  enet_qos.RGMII_RXC
  enet_qos.RGMII_RD0
  enet_qos.RGMII_RD1
  enet_qos.RGMII_RD2
  enet_qos.RGMII_RD3
  enet2.MDC
  enet2.MDIO
  enet2.RGMII_TD3
  enet2.RGMII_TD2
  enet2.RGMII_TD1
  enet2.RGMII_TD0
  enet2.RGMII_TX_CTL
  enet2.RGMII_TXC
  enet2.RGMII_RX_CTL
  enet2.RGMII_RXC
  enet2.RGMII_RD0
  enet2.RGMII_RD1
  enet2.RGMII_RD2
  enet2.RGMII_RD3
  usdhc1.CLK
  usdhc1.CMD
  usdhc1.DATA0
  usdhc1.DATA1
  usdhc1.DATA2
  usdhc1.DATA3
  usdhc1.DATA4
  usdhc1.DATA5
  usdhc1.DATA6
  usdhc1.DATA7
  usdhc1.STROBE
  usdhc2.VSELECT
  usdhc3.CLK
  usdhc3.CMD
  usdhc3.DATA0
  usdhc3.DATA1
  usdhc3.DATA2
  usdhc3.DATA3
  usdhc2.CD_B
  usdhc2.CLK
  usdhc2.CMD
  usdhc2.DATA0
  usdhc2.DATA1
  usdhc2.DATA2
  usdhc2.DATA3
  usdhc2.RESET_B
  i2c1.SCL
  i2c1.SDA
  i2c2.SCL
  i2c2.SDA
  uart1.RX
  uart1.TX
  uart2.RX
  uart2.TX
  pdm.CLK
  pdm.BIT_STREAM[0]
  pdm.BIT_STREAM[1]
  sai1.TX_SYNC
  sai1.TX_BCLK
  sai1.TX_DATA[0]
  sai1.RX_DATA[0]
  wdog1.WDOG_ANY
  anamix.CLKIN1
  anamix.CLKIN2
  anamix.xtali_24M
  anamix.xtalo_24M
  anamix.adc_in0
  anamix.adc_in1
  anamix.adc_in2
  anamix.adc_in3
- i2c3.SDA
  i2c3.SCL
  i2c4.SDA
  i2c4.SCL
  tpm3.CH0
  tpm4.CH0
  tpm5.CH0
  spi3.PCS1
  spi3.PCS0
  spi3.SIN
  spi3.SOUT
  spi3.SCK
  tpm3.CH2
  tpm4.CH2
  uart3.TX
  uart3.RX
  sai3.TX_BCLK
  sai3.MCLK
  sai3.RX_BCLK
  sai3.RX_SYNC
  sai3.RX_DATA[0]
  sai3.TX_DATA[0]
  usdhc3.CLK
  usdhc3.CMD
  usdhc3.DATA0
  usdhc3.DATA1
  usdhc3.DATA2
  usdhc3.DATA3
  i2c3.SDA
  i2c3.SCL
  mqs2.LEFT
  mqs2.RIGHT
  uart3.DCB_B
  uart3.RIN_B
  enet_qos.TX_CLK/.ENET_REF_CLK_ROOT
  uart3.RTS_B
  uart3.TX
  uart3.DTR_B
  enet_qos.TX_ER
  uart3.DSR_B
  enet_qos.RX_ER
  uart3.RX
  uart3.CTS_B
  uart4.DCB_B
  uart4.RIN_B
  enet2.TX_CLK/ENET_REF_CLK_ROOT
  uart4.RTS_B
  uart4.TX
  uart4.DTR_B
  enet2.TX_ER
  uart4.DSR_B
  enet2.RX_ER
  uart4.RX
  spdif1.IN
  uart4.CTS_B
  spdif1.OUT
  flexspi.A_SS1_B
  flexspi.A_DATA[4]
  flexspi.A_DATA[5]
  flexspi.A_DATA[6]
  flexspi.A_DATA[7]
  flexspi.A_DQS
  usdhc2.WP
  flexspi.A_SCLK
  flexspi.A_SS0_B
  flexspi.A_DATA[0]
  flexspi.A_DATA[1]
  flexspi.A_DATA[2]
  flexspi.A_DATA[3]
  enet_qos.1588_EVENT0_IN
  enet_qos.1588_EVENT0_OUT
  enet2.1588_EVENT0_IN
  enet2.1588_EVENT0_OUT
  enet2.1588_EVENT1_IN
  enet2.1588_EVENT1_OUT
  lptmr2.ALT1
  lptmr2.ALT2
  i3c1.SCL
  i3c1.SDA
  i3c1.PUR
  seco.RX
  seco.TX
  uart1.CTS_B
  uart1.RTS_B
  mqs1.LEFT
  mqs1.RIGHT
  m33.NMI
  sai1.TX_DATA[1]
  uart2.CTS_B
  uart2.RTS_B
  sai1.MCLK
  anamix.esd_diode
  anamix.atx
- isi.PCLK
  isi.D[0]
  isi.FRAME_VALID
  isi.LINE_VALID
  pdm.CLK
  pdm.BIT_STREAM[0]
  pdm.BIT_STREAM[1]
  isi.D[1]
  isi.D[2]
  isi.D[3]
  isi.D[4]
  isi.D[5]
  pdm.BIT_STREAM[2]
  pdm.BIT_STREAM[3]
  isi.D[6]
  isi.D[7]
  pdm.BIT_STREAM[2]
  isi.D[8]
  isi.D[9]
  pdm.BIT_STREAM[3]
  pdm.BIT_STREAM[0]
  pdm.CLK
  spdif1.IN
  spdif1.OUT
  can2.TX
  pdm.BIT_STREAM[1]
  can2.RX
  i3c2.SCL
  i3c2.SDA
  can2.TX
  can2.RX
  i3c2.PUR
  wakeupmix.flexspi_usdhc_tester_trigger
  sai2.RX_SYNC
  sai2.RX_BCLK
  sai2.RX_DATA[0]
  sai2.RX_DATA[1]
  sai2.RX_DATA[2]
  sai2.RX_DATA[3]
  sai2.TX_SYNC
  sai2.TX_BCLK
  sai2.TX_DATA[0]
  sai2.TX_DATA[1]
  sai2.TX_DATA[2]
  sai2.TX_DATA[3]
  sai2.MCLK
  spdif1.IN
  usdhc1.RESET_B
  usdhc1.CD_B
  usdhc1.WP
  lptmr2.ALT3
  i3c2.SCL
  i3c2.SDA
  i3c2.PUR
  can2.TX
  can2.RX
  mqs2.RIGHT
  mqs2.LEFT
  uart1.DCB_B
  uart1.RIN_B
  uart2.DCB_B
  uart2.RIN_B
  spi2.SIN
  spi2.PCS0
  spi2.SOUT
  spi2.SCK
  spi1.PCS1
  spi2.PCS1
  spi1.PCS0
  spi1.SIN
  spi1.SCK
  spi1.SOUT
- lcdif.PCLK
  lcdif.DE
  lcdif.VSYNC
  lcdif.HSYNC
  lcdif.D[0]
  lcdif.D[1]
  lcdif.D[2]
  lcdif.D[3]
  lcdif.D[4]
  lcdif.D[5]
  lcdif.D[6]
  lcdif.D[7]
  lcdif.D[8]
  lcdif.D[9]
  lcdif.D[10]
  lcdif.D[11]
  lcdif.D[12]
  lcdif.D[13]
  lcdif.D[14]
  lcdif.D[15]
  lcdif.D[16]
  lcdif.D[17]
  lcdif.D[18]
  lcdif.D[19]
  lcdif.D[20]
  lcdif.D[21]
  lcdif.D[22]
  lcdif.D[23]
  can2.TX
  can2.RX
  usb1.OTG_ID
  usb1.OTG_PWR
  usb2.OTG_ID
  usb2.OTG_OC
  usb1.OTG_OC
  usb2.OTG_PWR
  lptmr2.ALT1
  lptmr2.ALT2
  lptmr2.ALT3
  mqs2.RIGHT
  mqs2.LEFT
  i3c2.PUR_B
  tpm2.CH0
  tpm2.CH1
  tpm2.CH2
  tpm2.CH3
  tpm1.CH0
  tpm1.CH1
  tpm1.CH2
  tpm1.CH3
  tpm1.EXTCLK
  tpm2.EXTCLK
  uart2.DTR_B
  uart1.DSR_B
  uart1.DTR_B
  uart2.DSR_B
- spi6.PCS0
  spi6.SIN
  spi6.SOUT
  spi6.SCK
  spi7.PCS0
  spi7.SIN
  spi7.SOUT
  spi7.SCK
  tpm6.CH0
  tpm3.EXTCLK
  tpm4.EXTCLK
  tpm5.EXTCLK
  spi8.PCS0
  spi8.SIN
  spi8.SOUT
  spi8.SCK
  uart3.CTS_B
  uart3.RTS_B
  spi5.PCS0
  spi5.SIN
  spi5.SOUT
  spi5.SCK
  tpm5.CH1
  tpm6.CH1
  tpm3.CH3
  tpm4.CH3
  tpm5.CH3
  tpm6.CH3
  flexio1.FLEXIO[26]
  flexio1.FLEXIO[27]
  flexio2.FLEXIO[28]
  flexio2.FLEXIO[29]
  flexio2.FLEXIO[30]
  flexio2.FLEXIO[31]
  flexio1.FLEXIO[30]
  flexio1.FLEXIO[31]
  flexio2.FLEXIO[0]
  flexio2.FLEXIO[1]
  flexio2.FLEXIO[2]
  flexio2.FLEXIO[3]
  flexio2.FLEXIO[4]
  flexio2.FLEXIO[5]
  flexio2.FLEXIO[6]
  flexio2.FLEXIO[7]
  flexio2.FLEXIO[8]
  flexio2.FLEXIO[9]
  flexio2.FLEXIO[10]
  flexio2.FLEXIO[11]
  flexio2.FLEXIO[12]
  flexio2.FLEXIO[13]
  flexio2.FLEXIO[14]
  flexio2.FLEXIO[15]
  flexio2.FLEXIO[16]
  flexio2.FLEXIO[17]
  flexio2.FLEXIO[18]
  flexio2.FLEXIO[19]
  flexio2.FLEXIO[20]
  flexio2.FLEXIO[21]
  flexio2.FLEXIO[22]
  flexio2.FLEXIO[23]
  flexio2.FLEXIO[24]
  flexio2.FLEXIO[25]
  flexio2.FLEXIO[26]
  flexio2.FLEXIO[27]
  flexio1.FLEXIO[8]
  flexio1.FLEXIO[9]
  flexio1.FLEXIO[10]
  flexio1.FLEXIO[11]
  flexio1.FLEXIO[12]
  flexio1.FLEXIO[13]
  flexio1.FLEXIO[14]
  flexio1.FLEXIO[15]
  flexio1.FLEXIO[16]
  flexio1.FLEXIO[17]
  flexio1.FLEXIO[18]
  flexio1.FLEXIO[19]
  flexio1.FLEXIO[20]
  flexio1.FLEXIO[21]
  flexio1.FLEXIO[22]
  flexio1.FLEXIO[23]
  flexio1.FLEXIO[24]
  flexio1.FLEXIO[25]
  flexio1.FLEXIO[0]
  flexio1.FLEXIO[1]
  flexio1.FLEXIO[2]
  flexio1.FLEXIO[3]
  flexio1.FLEXIO[4]
  flexio1.FLEXIO[5]
  flexio1.FLEXIO[6]
  flexio1.FLEXIO[7]
  sai1.RX_SYNC
  sai1.RX_BCLK
  sai1.MCLK
  lptmr1.ALT1
  lptmr1.ALT2
  lptmr1.ALT3
  mqs1.LEFT
  can1.RX
  can1.TX
  mqs1.RIGHT
- uart5.TX
  uart5.RX
  uart5.CTS_B
  uart5.RTS_B
  uart6.TX
  uart6.RX
  uart6.CTS_B
  uart6.RTS_B
  uart7.TX
  uart7.RX
  uart7.CTS_B
  uart7.RTS_B
  uart8.TX
  uart8.RX
  uart8.CTS_B
  uart8.RTS_B
  spi4.PCS2
  spi4.PCS1
  spi4.PCS0
  spi4.SIN
  spi4.SOUT
  spi4.SCK
  tpm6.EXTCLK
  dap.TDO_TRACESWO
  dap.TCLK_SWCLK
  dap.TDI
  dap.TMS_SWDIO
  gpio3.IO[26]
  gpio3.IO[27]
  gpio4.IO[28]
  gpio4.IO[29]
  gpio3.IO[28]
  gpio3.IO[29]
  gpio3.IO[30]
  gpio3.IO[31]
  gpio4.IO[0]
  gpio4.IO[1]
  gpio4.IO[2]
  gpio4.IO[3]
  gpio4.IO[4]
  gpio4.IO[5]
  gpio4.IO[6]
  gpio4.IO[7]
  gpio4.IO[8]
  gpio4.IO[9]
  gpio4.IO[10]
  gpio4.IO[11]
  gpio4.IO[12]
  gpio4.IO[13]
  gpio4.IO[14]
  gpio4.IO[15]
  gpio4.IO[16]
  gpio4.IO[17]
  gpio4.IO[18]
  gpio4.IO[19]
  gpio4.IO[20]
  gpio4.IO[21]
  gpio4.IO[22]
  gpio4.IO[23]
  gpio4.IO[24]
  gpio4.IO[25]
  gpio4.IO[26]
  gpio4.IO[27]
  gpio3.IO[8]
  gpio3.IO[9]
  gpio3.IO[10]
  gpio3.IO[11]
  gpio3.IO[12]
  gpio3.IO[13]
  gpio3.IO[14]
  gpio3.IO[15]
  gpio3.IO[16]
  gpio3.IO[17]
  gpio3.IO[18]
  gpio3.IO[19]
  gpio3.IO[20]
  gpio3.IO[21]
  gpio3.IO[22]
  gpio3.IO[23]
  gpio3.IO[24]
  gpio3.IO[25]
  gpio3.IO[0]
  gpio3.IO[1]
  gpio3.IO[2]
  gpio3.IO[3]
  gpio3.IO[4]
  gpio3.IO[5]
  gpio3.IO[6]
  gpio3.IO[7]
  gpio1.IO[0]
  gpio1.IO[1]
  gpio1.IO[2]
  gpio1.IO[3]
  gpio1.IO[4]
  gpio1.IO[5]/ccmsrcgpcmix.BOOT_MODE[0]
  gpio1.IO[6]
  gpio1.IO[7]/ccmsrcgpcmix.BOOT_MODE[1]
  gpio1.IO[8]
  gpio1.IO[9]
  gpio1.IO[10]
  gpio1.IO[11]/ccmsrcgpcmix.BOOT_MODE[2]
  gpio1.IO[12]
  gpio1.IO[13]/ccmsrcgpcmix.BOOT_MODE[3]
  gpio1.IO[14]
  gpio1.IO[15]
- i2c5.SDA
  i2c5.SCL
  i2c6.SDA
  i2c6.SCL
  i2c6.SDA
  i2c6.SCL
  i2c7.SDA
  i2c7.SCL
  i2c7.SDA
  i2c7.SCL
  i2c8.SDA
  i2c8.SCL
  i2c8.SDA
  i2c8.SCL
  uart4.TX
  uart4.RX
  uart4.CTS_B
  uart4.RTS_B
  tpm5.CH2
  tpm6.CH2
  tpm3.CH1
  tpm4.CH1
  i2c5.SDA
  i2c5.SCL
  spi6.PCS1
  spi7.PCS1
  spi8.PCS1
  spi5.PCS1
  uart5.RX
  uart5.RTS_B
  uart5.CTS_B
  uart5.TX
  i3c2.PUR_B
  ccmsrcgpcmix.INT_BOOT
  ccmsrcgpcmix.PMIC_READY
  ccmsrcgpcmix.EXT_CLK1
  ccmsrcgpcmix.TESTER_ACK
  ccmsrcgpcmix.OBSERVE0
  ccmsrcgpcmix.OBSERVE1
  ccmsrcgpcmix.OBSERVE2
  ccmsrcgpcmix.WAIT
  ccmsrcgpcmix.STOP
  ccmsrcgpcmix.EARLY_RESET
  ccmsrcgpcmix.SYSTEM_RESET
  i3c1.PUR_B
  can1.TX
  can1.RX
  ccmsrcgpcmix.EXT_CLK1
- flexio1.FLEXIO[0]
  flexio1.FLEXIO[1]
  flexio1.FLEXIO[2]
  flexio1.FLEXIO[3]
  flexio1.FLEXIO[4]
  flexio1.FLEXIO[5]
  flexio1.FLEXIO[6]
  flexio1.FLEXIO[7]
  flexio1.FLEXIO[8]
  flexio1.FLEXIO[9]
  flexio1.FLEXIO[10]
  flexio1.FLEXIO[11]
  sai3.RX_SYNC
  flexio1.FLEXIO[13]
  flexio1.FLEXIO[14]
  flexio1.FLEXIO[15]
  flexio1.FLEXIO[16]
  flexio1.FLEXIO[17]
  flexio1.FLEXIO[18]
  sai3.TX_DATA[0]
  flexio1.FLEXIO[20]
  sai3.RX_BCLK
  flexio1.FLEXIO[22]
  flexio1.FLEXIO[23]
  flexio1.FLEXIO[24]
  flexio1.FLEXIO[25]
  sai3.TX_SYNC
  flexio1.FLEXIO[27]
  flexio1.FLEXIO[28]
  flexio1.FLEXIO[29]
- DWG. NO.
- REV.
- SHT.
- REVISION
- DESCRIPTION
- DATE
- APPROVED
- ENG:
- APPROVALS
- quilter.ai <http://quilter.ai>
- DSN:
- CHK:
- REFERENCE DOCUMENTS
- TITLE
- PROJECT
- BOM:
- FAB DWG:
- PCB DWG:
- ASSY DWG:
- SIZE
- FILE NAME
- C
- DWG NO.
- SHEET
- OF
- REV
- (in symbol TitleBlock_MCPG) Microcontroller Product Group; 6501 William Cannon Drive West / Austin, TX 78735-8598; This document contains information proprietary to NXP and shall not be used for engineering design,; procurement or manufacture in whole or in part without the express written permission of NXP Semiconductors.; ©; NXP SEMICONDUCTORS; Classification:; Designer:; Drawing Title:; Drawn by:; Page Title:; Approved:; Size; Document Number; Rev; Date:; Sheet; of

### Library data of the parts
*#23 = TitleBlock_MCPG: as *#22 on sheet X-22 NOTE; Page Size: =PageSize; Page Create Date: March  8, 1995; Page Count: 23; Designer: FORLINX; Page Modify Date: =ModifiedDate